# Altium project Computer_Board.PrjPcb (part 2 of 3)

## Sheet SCH7_Main_Computer_PCIe.SchDoc: Main Computer - PCIe
size B; Organization: CWRUbotix; Address1: 10900 Euclid Avenue; Address2: Cleveland, OH 44106; Address3: USA; Revision: 1.0; SheetNumber: 7; SheetTotal: 13
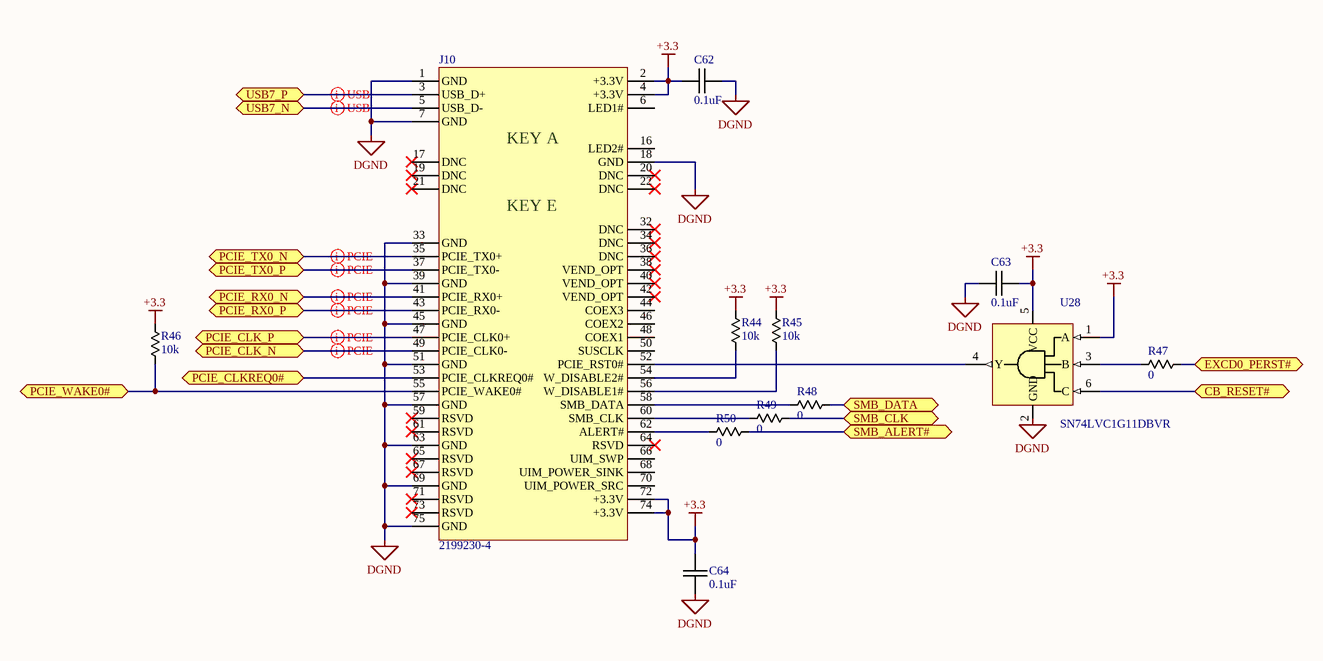
[diagram p6: SCH7_Main_Computer_PCIe.SchDoc]

### Parts
C62  0.1uF  [chip_0603]
C63  0.1uF  [chip_0603]
C64  0.1uF  [chip_0603]
J10  2199230-4  [TE_CONN_2199230-4]
R44  10k  [chip_0603]
R45  10k  [chip_0603]
R46  10k  [chip_0603]
R47  0  [chip_0805]
R48  0  [chip_0805]
R49  0  [chip_0805]
R50  0  [chip_0805]
U28  SN74LVC1G11DBVR  [sot-23-6]

### Ports
CB_RESET# (bidir), EXCD0_PERST# (bidir), PCIE_CLK_N (bidir), PCIE_CLK_P (bidir), PCIE_CLKREQ0# (bidir), PCIE_RX0_N (bidir), PCIE_RX0_P (bidir), PCIE_TX0_N (bidir), PCIE_TX0_P (bidir), PCIE_WAKE0# (bidir), SMB_ALERT# (bidir), SMB_CLK (bidir), SMB_DATA (bidir), USB7_N (bidir), USB7_P (bidir)

### Nets
+3.3: C62.1 C63.2 C64.2 J10.2(+3.3V) J10.4(+3.3V) J10.72(+3.3V) J10.74(+3.3V) R44.1 R45.1 R46.1 U28.1(A) U28.5(VCC)
DGND: C62.2 C63.1 C64.1 J10.1(GND) J10.7(GND) J10.18(GND) J10.33(GND) J10.39(GND) J10.45(GND) J10.51(GND) J10.57(GND) J10.63(GND) J10.69(GND) J10.75(GND) U28.2(GND)
CB_RESET#: U28.6(C) ; port CB_RESET#
EXCD0_PERST#: R47.1 ; port EXCD0_PERST#
PCIE_CLK_N: J10.49(PCIE_CLK0-) ; port PCIE_CLK_N
PCIE_CLK_P: J10.47(PCIE_CLK0+) ; port PCIE_CLK_P
PCIE_CLKREQ0#: J10.53(PCIE_CLKREQ0#) ; port PCIE_CLKREQ0#
PCIE_RX0_N: J10.41(PCIE_RX0+) ; port PCIE_RX0_N
PCIE_RX0_P: J10.43(PCIE_RX0-) ; port PCIE_RX0_P
PCIE_TX0_N: J10.35(PCIE_TX0+) ; port PCIE_TX0_N
PCIE_TX0_P: J10.37(PCIE_TX0-) ; port PCIE_TX0_P
PCIE_WAKE0#: J10.55(PCIE_WAKE0#) R46.2 ; port PCIE_WAKE0#
SMB_ALERT#: R50.1 ; port SMB_ALERT#
SMB_CLK: R49.1 ; port SMB_CLK
SMB_DATA: R48.1 ; port SMB_DATA
USB7_N: J10.5(USB_D-) ; port USB7_N
USB7_P: J10.3(USB_D+) ; port USB7_P
NetJ10_52: J10.52(PCIE_RST0#) U28.4(Y)
NetJ10_54: J10.54(W_DISABLE2#) R44.2
NetJ10_56: J10.56(W_DISABLE1#) R45.2
NetJ10_58: J10.58(SMB_DATA) R48.2
NetJ10_60: J10.60(SMB_CLK) R49.2
NetJ10_62: J10.62(ALERT#) R50.2
NetR47_2: R47.2 U28.3(B)

Not connected (* = marked no-connect by the designer): J10 6(LED1#) 16(LED2#) 17(DNC)* 19(DNC)* 20(DNC)* 21(DNC)* 22(DNC)* 32(DNC)* 34(DNC)* 36(DNC)* 38(VEND_OPT)* 40(VEND_OPT)* 42(VEND_OPT)* 44(COEX3) 46(COEX2) 48(COEX1) 50(SUSCLK) 59(RSVD)* 61(RSVD)* 64(RSVD)* 65(RSVD)* 66(UIM_SWP) 67(RSVD)* 68(UIM_POWER_SINK) 70(UIM_POWER_SRC) 71(RSVD)* 73(RSVD)*

### Layout directives
differential pair: PCIE_CLK_N, PCIE_CLK_P, PCIE_RX0_N, PCIE_RX0_P, PCIE_TX0_N, PCIE_TX0_P, USB7_N, USB7_P

### Notes on the sheet
- Title
- Size:
- B
- Number:
- Revision:
- Date:
- Sheet
- of
- (in symbol CONN-00088) KEY A; KEY E

### Library data of the parts
C62-C64 = CAP-00542: as C1 on sheet SCH1_Power; Part Number: CAP-00542; Capacitance: 0.1uF; Tolerance: ±10%; Voltage Rating: 16V; Type: X7R
J10 = CONN-00088: Card-Edge Socket, NGFF (M.2) E-Keyed, PCIe Card Socket; Manufacturer: TE Connectivity; Part Number: CONN-00088; Type: Card Socket; Manufacturer PN: 2199230-4; Cost: 1.33
R44-R46 = RES-00306: as R1 on sheet SCH1_Power; Part Number: RES-00306; Resistance: 10k; Tolerance: 1%; Cost: 0.144
R47-R50 = RES-00720: as R125 on sheet SCH1_Power; Part Number: RES-00720; Resistance: 0; Power Rating: 1/8W; Cost: 0.1
U28 = LOGIC-00042: IC, AND Gate, Single 3-Input, 1.65-5.5V, SOT-23-6; Manufacturer: TI; Part Number: LOGIC-00042; Manufacturer PN: SN74LVC1G11DBVR; Cost: $0.37

## Sheet SCH8_BBB.SchDoc: Beaglebone Black
size B; Organization: CWRUbotix; Address1: 10900 Euclid Avenue; Address2: Cleveland, OH 44106; Address3: USA; Revision: 1.0; SheetNumber: 8; SheetTotal: 13
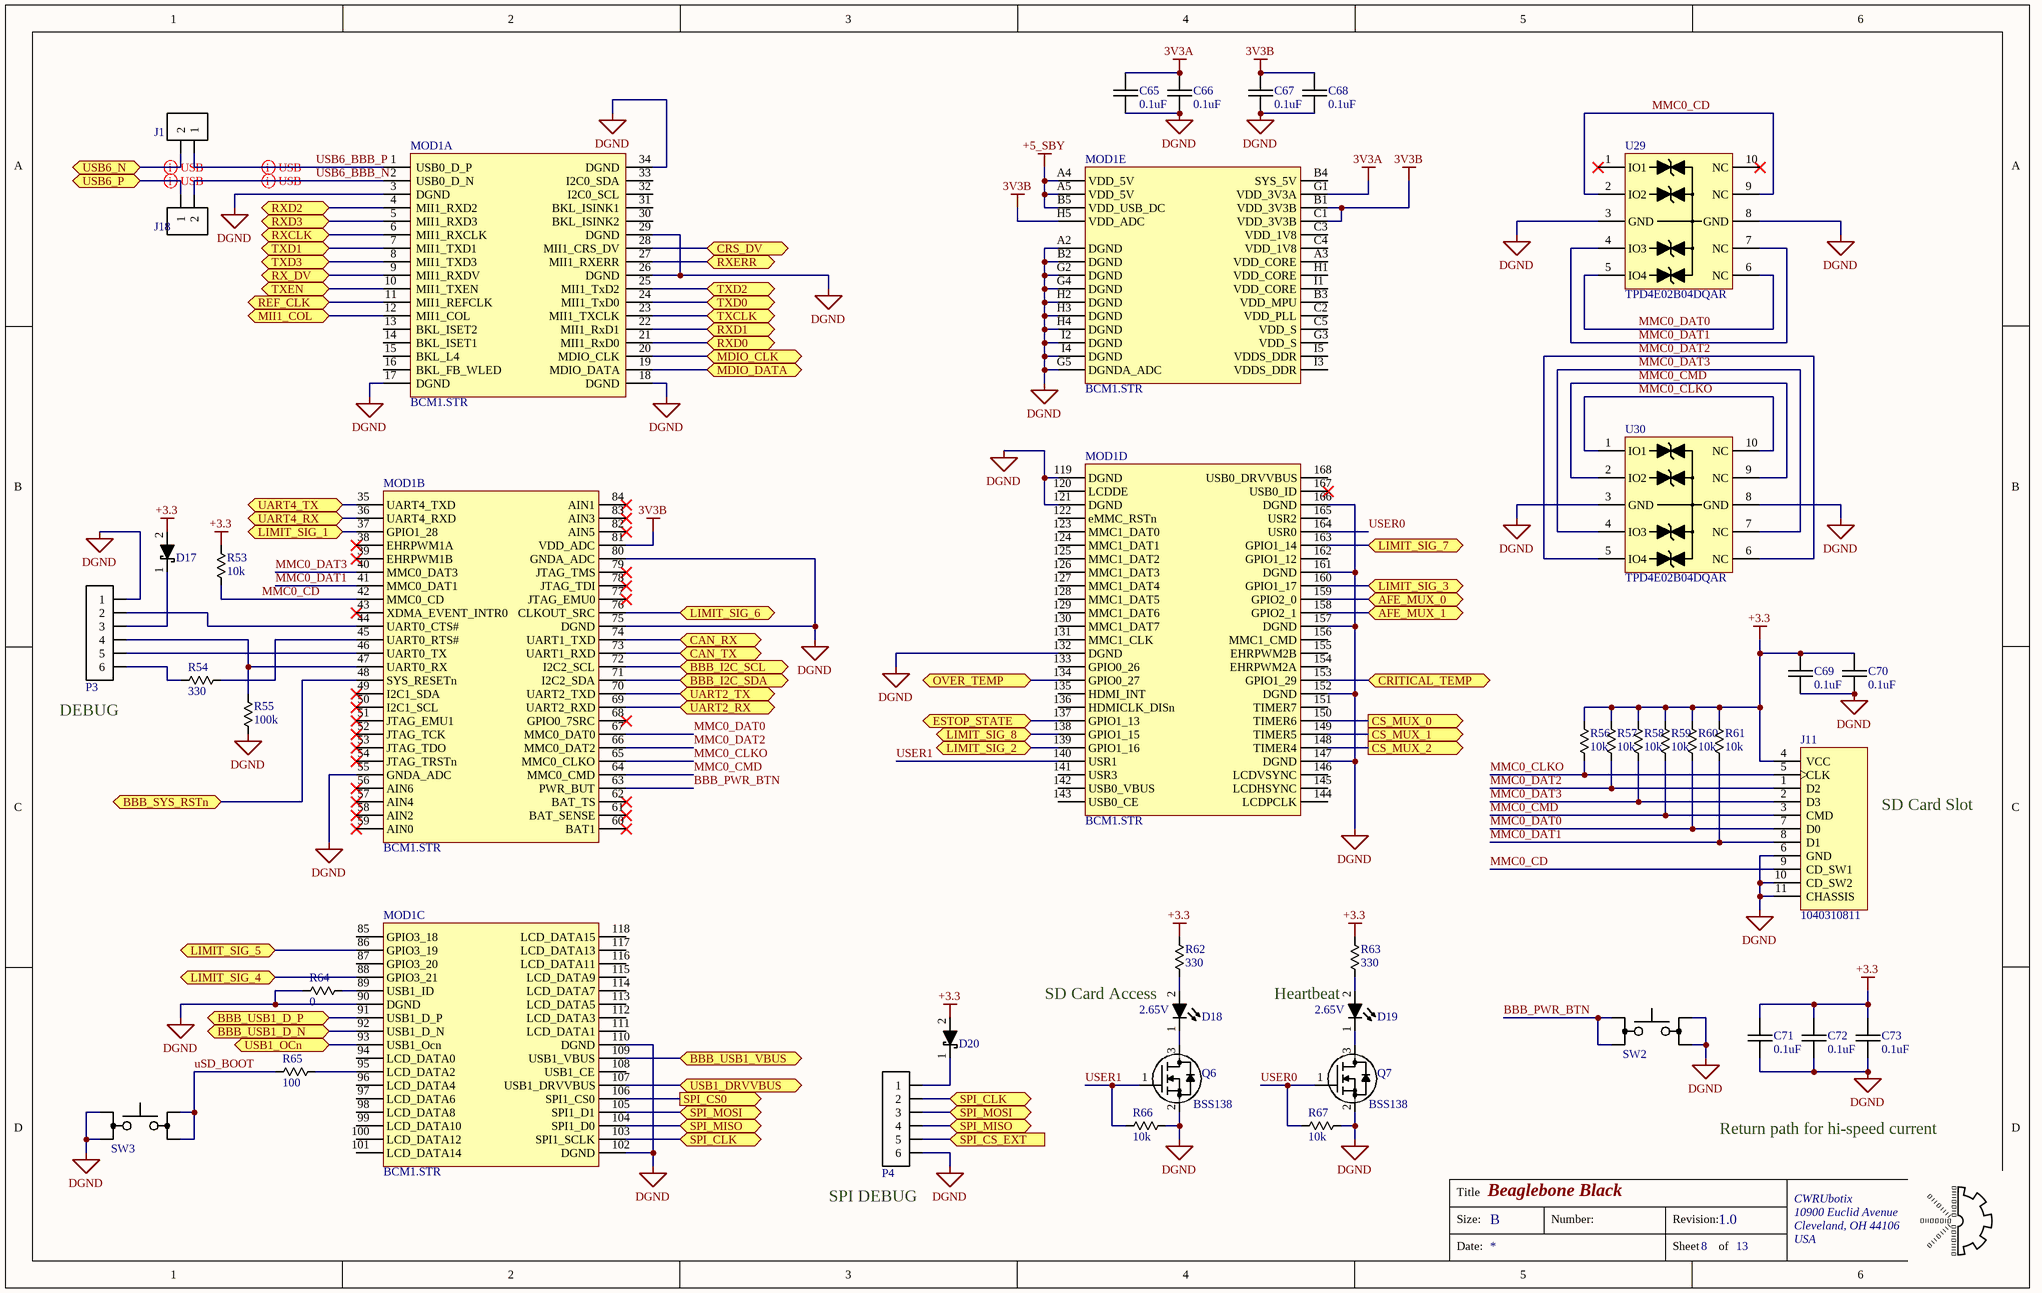
[diagram p7: SCH8_BBB.SchDoc]

### Parts
C65  0.1uF  [chip_0603]
C66  0.1uF  [chip_0603]
C67  0.1uF  [chip_0603]
C68  0.1uF  [chip_0603]
C69  0.1uF  [chip_0603]
C70  0.1uF  [chip_0603]
C71  0.1uF  [chip_0603]
C72  0.1uF  [chip_0603]
C73  0.1uF  [chip_0603]
D17  diode_2  [sod123_0]  (value not drawn)
D18  Forward Voltage: 2.65V  [chip_0603_LED]  (hidden comment: diode_4)
D19  Forward Voltage: 2.65V  [chip_0603_LED]  (hidden comment: diode_4)
D20  diode_2  [sod123_0]  (value not drawn)
J1  conn-2x1_0  [HDDR_2x1_0]  (value not drawn)
J11  1040310811  [MOLEX_1040310811]
J18  conn-2x1_0  [HDDR_2x1_0]  (value not drawn)
MOD1  BCM1.STR  [BEAGLECORE_BCM1]  (parts A,B,C,D,E of 5)
P3  conn-6x1_0  [HDDR_6X1_0]  (value not drawn)
P4  conn-6x1_0  [HDDR_6X1_0]  (value not drawn)
Q6  Manufacturer PN: BSS138  [sot-23-3]  (hidden comment: n-mosfet_1)
Q7  Manufacturer PN: BSS138  [sot-23-3]  (hidden comment: n-mosfet_1)
R53  10k  [chip_0603]
R54  330  [chip_0603]
R55  100k  [chip_0603]
R56  10k  [chip_0603]
R57  10k  [chip_0603]
R58  10k  [chip_0603]
R59  10k  [chip_0603]
R60  10k  [chip_0603]
R61  10k  [chip_0603]
R62  330  [chip_0603]
R63  330  [chip_0603]
R64  0  [chip_0805]
R65  100  [chip_0603]
R66  10k  [chip_0603]
R67  10k  [chip_0603]
SW2  SW_1P1T_2  [B3FS-1000]  (value not drawn)
SW3  SW_1P1T_2  [B3FS-1000]  (value not drawn)
U29  TPD4E02B04DQAR  [USON-10]
U30  TPD4E02B04DQAR  [USON-10]

### Ports
AFE_MUX_0 (bidir), AFE_MUX_1 (bidir), BBB_I2C_SCL (bidir), BBB_I2C_SDA (bidir), BBB_SYS_RSTn (bidir), BBB_USB1_D_N (bidir), BBB_USB1_D_P (bidir), BBB_USB1_VBUS (bidir), CAN_RX (bidir), CAN_TX (bidir), CRITICAL_TEMP (bidir), CRS_DV (bidir), CS_MUX_0 (out), CS_MUX_1 (out), CS_MUX_2 (out), ESTOP_STATE (bidir), LIMIT_SIG_1 (bidir), LIMIT_SIG_2 (bidir), LIMIT_SIG_3 (bidir), LIMIT_SIG_4 (bidir), LIMIT_SIG_5 (bidir), LIMIT_SIG_6 (bidir), LIMIT_SIG_7 (bidir), LIMIT_SIG_8 (bidir), MDIO_CLK (bidir), MDIO_DATA (bidir), MII1_COL (bidir), OVER_TEMP (bidir), REF_CLK (bidir), RX_DV (bidir), RXCLK (bidir), RXD0 (bidir), RXD1 (bidir), RXD2 (bidir), RXD3 (bidir), RXERR (bidir), SPI_CLK (bidir), SPI_CS0 (out), SPI_CS_EXT (in), SPI_MISO (bidir), SPI_MOSI (bidir), TXCLK (bidir), TXD0 (bidir), TXD1 (bidir), TXD2 (bidir), TXD3 (bidir), TXEN (bidir), UART2_RX (bidir), UART2_TX (bidir), UART4_RX (bidir), UART4_TX (bidir), USB1_DRVVBUS (bidir), USB1_OCn (bidir), USB6_N (bidir), USB6_P (bidir)

### Nets
3V3A: C65.2 C66.2 MOD1.G1(VDD_3V3A)
3V3B: C67.2 C68.2 MOD1.81(VDD_ADC) MOD1.B1(VDD_3V3B) MOD1.C1(VDD_3V3B) MOD1.H5(VDD_ADC)
+3.3: C69.2 C70.2 C71.2 C72.2 C73.2 D17.2 D20.2 J11.4(VCC) R53.1 R56.1 R57.1 R58.1 R59.1 R60.1 R61.1 R62.2 R63.2
+5_SBY: MOD1.A4(VDD_5V) MOD1.A5(VDD_5V) MOD1.B5(VDD_USB_DC)
DGND: C65.1 C66.1 C67.1 C68.1 C69.1 C70.1 C71.1 C72.1 C73.1 J11.6(GND) J11.10(CD_SW2) J11.11(CHASSIS) MOD1.3(DGND) MOD1.17(DGND) MOD1.18(DGND) MOD1.26(DGND) MOD1.29(DGND) MOD1.34(DGND) MOD1.55(GNDA_ADC) MOD1.75(DGND) MOD1.80(GNDA_ADC) MOD1.90(DGND) MOD1.102(DGND) MOD1.110(DGND) MOD1.119(DGND) MOD1.121(DGND) MOD1.132(DGND) MOD1.147(DGND) MOD1.152(DGND) MOD1.157(DGND) MOD1.161(DGND) MOD1.166(DGND) MOD1.A2(DGND) MOD1.B2(DGND) MOD1.G2(DGND) MOD1.G4(DGND) MOD1.G5(DGNDA_ADC) MOD1.H2(DGND) MOD1.H3(DGND) MOD1.H4(DGND) MOD1.I2(DGND) MOD1.I4(DGND) P3.1 P4.6 Q6.2(S) Q7.2(S) R55.1 R64.1 R66.2 R67.2 SW2.3 SW2.4 SW3.1 SW3.2 U29.3(GND) U29.8(GND) U30.3(GND) U30.8(GND)
AFE_MUX_0: MOD1.159(GPIO2_0) ; port AFE_MUX_0
AFE_MUX_1: MOD1.158(GPIO2_1) ; port AFE_MUX_1
BBB_I2C_SCL: MOD1.72(I2C2_SCL) ; port BBB_I2C_SCL
BBB_I2C_SDA: MOD1.71(I2C2_SDA) ; port BBB_I2C_SDA
BBB_PWR_BTN: MOD1.63(PWR_BUT) SW2.1 SW2.2
BBB_SYS_RSTn: MOD1.48(SYS_RESETn) ; port BBB_SYS_RSTn
BBB_USB1_D_N: MOD1.92(USB1_D_N) ; port BBB_USB1_D_N
BBB_USB1_D_P: MOD1.91(USB1_D_P) ; port BBB_USB1_D_P
BBB_USB1_VBUS: MOD1.109(USB1_VBUS) ; port BBB_USB1_VBUS
CAN_RX: MOD1.74(UART1_TXD) ; port CAN_RX
CAN_TX: MOD1.73(UART1_RXD) ; port CAN_TX
CRITICAL_TEMP: MOD1.153(GPIO1_29) ; port CRITICAL_TEMP
CRS_DV: MOD1.28(MII1_CRS_DV) ; port CRS_DV
CS_MUX_0: MOD1.150(TIMER6) ; port CS_MUX_0
CS_MUX_1: MOD1.149(TIMER5) ; port CS_MUX_1
CS_MUX_2: MOD1.148(TIMER4) ; port CS_MUX_2
ESTOP_STATE: MOD1.137(GPIO1_13) ; port ESTOP_STATE
LIMIT_SIG_1: MOD1.37(GPIO1_28) ; port LIMIT_SIG_1
LIMIT_SIG_2: MOD1.139(GPIO1_16) ; port LIMIT_SIG_2
LIMIT_SIG_3: MOD1.160(GPIO1_17) ; port LIMIT_SIG_3
LIMIT_SIG_4: MOD1.88(GPIO3_21) ; port LIMIT_SIG_4
LIMIT_SIG_5: MOD1.86(GPIO3_19) ; port LIMIT_SIG_5
LIMIT_SIG_6: MOD1.76(CLKOUT_SRC) ; port LIMIT_SIG_6
LIMIT_SIG_7: MOD1.163(GPIO1_14) ; port LIMIT_SIG_7
LIMIT_SIG_8: MOD1.138(GPIO1_15) ; port LIMIT_SIG_8
MDIO_CLK: MOD1.20(MDIO_CLK) ; port MDIO_CLK
MDIO_DATA: MOD1.19(MDIO_DATA) ; port MDIO_DATA
MII1_COL: MOD1.12(MII1_COL) ; port MII1_COL
MMC0_CD: J11.9(CD_SW1) MOD1.42(MMC0_CD) R53.2 U29.2(IO2) U29.9(NC)
MMC0_CLKO: J11.5(CLK) MOD1.65(MMC0_CLKO) R56.2 U30.1(IO1) U30.10(NC)
MMC0_CMD: J11.3(CMD) MOD1.64(MMC0_CMD) R59.2 U30.2(IO2) U30.9(NC)
MMC0_DAT0: J11.7(D0) MOD1.67(MMC0_DAT0) R60.2 U29.5(IO4) U29.6(NC)
MMC0_DAT1: J11.8(D1) MOD1.41(MMC0_DAT1) R61.2 U29.4(IO3) U29.7(NC)
MMC0_DAT2: J11.1(D2) MOD1.66(MMC0_DAT2) R57.2 U30.5(IO4) U30.6(NC)
MMC0_DAT3: J11.2(D3) MOD1.40(MMC0_DAT3) R58.2 U30.4(IO3) U30.7(NC)
OVER_TEMP: MOD1.134(GPIO0_27) ; port OVER_TEMP
REF_CLK: MOD1.11(MII1_REFCLK) ; port REF_CLK
RX_DV: MOD1.9(MII1_RXDV) ; port RX_DV
RXCLK: MOD1.6(MII1_RXCLK) ; port RXCLK
RXD0: MOD1.21(MII1_RxD0) ; port RXD0
RXD1: MOD1.22(MII1_RxD1) ; port RXD1
RXD2: MOD1.4(MII1_RXD2) ; port RXD2
RXD3: MOD1.5(MII1_RXD3) ; port RXD3
RXERR: MOD1.27(MII1_RXERR) ; port RXERR
SPI_CLK: MOD1.103(SPI1_SCLK) P4.2 ; port SPI_CLK
SPI_CS0: MOD1.106(SPI1_CS0) ; port SPI_CS0
SPI_CS_EXT: P4.5 ; port SPI_CS_EXT
SPI_MISO: MOD1.104(SPI1_D0) P4.4 ; port SPI_MISO
SPI_MOSI: MOD1.105(SPI1_D1) P4.3 ; port SPI_MOSI
TXCLK: MOD1.23(MII1_TXCLK) ; port TXCLK
TXD0: MOD1.24(MII1_TxD0) ; port TXD0
TXD1: MOD1.7(MII1_TXD1) ; port TXD1
TXD2: MOD1.25(MII1_TxD2) ; port TXD2
TXD3: MOD1.8(MII1_TXD3) ; port TXD3
TXEN: MOD1.10(MII1_TXEN) ; port TXEN
UART2_RX: MOD1.69(UART2_RXD) ; port UART2_RX
UART2_TX: MOD1.70(UART2_TXD) ; port UART2_TX
UART4_RX: MOD1.36(UART4_RXD) ; port UART4_RX
UART4_TX: MOD1.35(UART4_TXD) ; port UART4_TX
USB1_DRVVBUS: MOD1.107(USB1_DRVVBUS) ; port USB1_DRVVBUS
USB1_OCn: MOD1.93(USB1_Ocn) ; port USB1_OCn
USB6_BBB_N: J18.2 MOD1.2(USB0_D_N)
USB6_BBB_P: J1.1 MOD1.1(USB0_D_P)
USB6_N: J1.2 ; port USB6_N
USB6_P: J18.1 ; port USB6_P
uSD_BOOT: R65.1 SW3.3 SW3.4
USER0: MOD1.164(USR0) Q7.1(G) R67.1
USER1: MOD1.140(USR1) Q6.1(G) R66.1
NetD17_1: D17.1 P3.3
NetD18_1: D18.1 Q6.3(D)
NetD18_2: D18.2 R62.1
NetD19_1: D19.1 Q7.3(D)
NetD19_2: D19.2 R63.1
NetD20_1: D20.1 P4.1
NetMOD1_44: MOD1.44(UART0_CTS#) P3.2
NetMOD1_45: MOD1.45(UART0_RTS#) R54.1
NetMOD1_46: MOD1.46(UART0_TX) P3.5
NetMOD1_47: MOD1.47(UART0_RX) P3.4 R55.2
NetMOD1_89: MOD1.89(USB1_ID) R64.2
NetMOD1_95: MOD1.95(LCD_DATA2) R65.2
NetP3_6: P3.6 R54.2

Not connected (* = marked no-connect by the designer): MOD1 13(BKL_ISET2) 14(BKL_ISET1) 15(BKL_L4) 16(BKL_FB_WLED) 30(BKL_ISINK2) 31(BKL_ISINK1) 32(I2C0_SCL) 33(I2C0_SDA) 38(EHRPWM1A)* 39(EHRPWM1B)* 43(XDMA_EVENT_INTR0)* 49(I2C1_SDA)* 50(I2C1_SCL)* 51(JTAG_EMU1)* 52(JTAG_TCK)* 53(JTAG_TDO)* 54(JTAG_TRSTn)* 56(AIN6)* 57(AIN4)* 58(AIN2)* 59(AIN0)* 60(BAT1)* 61(BAT_SENSE)* 62(BAT_TS)* 68(GPIO0_7SRC)* 77(JTAG_EMU0)* 78(JTAG_TDI)* 79(JTAG_TMS)* 82(AIN5)* 83(AIN3)* 84(AIN1)* 85(GPIO3_18) 87(GPIO3_20) 94(LCD_DATA0) 96(LCD_DATA4) 97(LCD_DATA6) 98(LCD_DATA8) 99(LCD_DATA10) 100(LCD_DATA12) 101(LCD_DATA14) 108(USB1_CE) 111(LCD_DATA1) 112(LCD_DATA3) 113(LCD_DATA5) 114(LCD_DATA7) 115(LCD_DATA9) 116(LCD_DATA11) 117(LCD_DATA13) 118(LCD_DATA15) 120(LCDDE) 122(eMMC_RSTn) 123(MMC1_DAT0) 124(MMC1_DAT1) 125(MMC1_DAT2) 126(MMC1_DAT3) 127(MMC1_DAT4) 128(MMC1_DAT5) 129(MMC1_DAT6) 130(MMC1_DAT7) 131(MMC1_CLK) 133(GPIO0_26) 135(HDMI_INT) 136(HDMICLK_DISn) 141(USR3) 142(USB0_VBUS) 143(USB0_CE) 144(LCDPCLK) 145(LCDHSYNC) 146(LCDVSYNC) 151(TIMER7) 154(EHRPWM2A) 155(EHRPWM2B) 156(MMC1_CMD) 162(GPIO1_12) 165(USR2) 167(USB0_ID)* 168(USB0_DRVVBUS) A3(VDD_CORE) B3(VDD_MPU) B4(SYS_5V) C2(VDD_PLL) C3(VDD_1V8) C4(VDD_1V8) C5(VDD_S) G3(VDD_S) H1(VDD_CORE) I1(VDD_CORE) I3(VDDS_DDR) I5(VDDS_DDR); U29 1(IO1)* 10(NC)*

### Layout directives
differential pair: USB6_BBB_N, USB6_BBB_P, USB6_N, USB6_P

### Notes on the sheet
- (near P3) DEBUG
- SD Card Slot
- SD Card Access
- (near D19) Heartbeat
- Return path for hi-speed current
- (near P4) SPI DEBUG
- Title
- Size:
- B
- Number:
- Revision:
- Date:
- Sheet
- of

### Library data of the parts
C65-C73 = CAP-00542: CAP, 0.1uF, ±10%, 16V, X7R, 0603; Manufacturer: Murata; Part Number: CAP-00542; Capacitance: 0.1uF; Tolerance: ±10%; Voltage Rating: 16V; Type: X7R
D17 D20 = DIO-00001: Dio Shtky, 1A, 0.55V, 40V, SOD-123; Manufacturer: ON Semi; Manufacturer PN: MBR140SFT1G; Forward Voltage: 550mV; Type: Schottky; Part Number: DIO-00001; Reverse Breakdown Voltage: 40V; Current Rating: 1A
D18 D19 = DIO-00049: LED, Blue, 0603, Low current, HELI2 Series; Manufacturer: Kingbright; Manufacturer PN: APT1608LVBC/D; Reverse Breakdown Voltage: 5V; Power Rating: 120mW; Current Rating: 30mA; Part Number: DIO-00049; Type: LED; Cost: 0.58
J1 J18 = CONN-00055: Header, 2x1, 0.1"; Manufacturer: Samtec; Manufacturer PN: TSW-102-07-F-S; Positions per level: 2; Levels: 1; Part Number: CONN-00055; Type: Header; Cost: 0.2
J11 = CONN-00091: Micro SD Card Slot, Push-Pull w/ Card-Detect Switch, SMD, Molex; Positions per level: 10; Levels: 1; Part Number: CONN-00091; Type: Card Socket; Manufacturer: Molex; Manufacturer PN: 1040310811; Cost: 2.02
MOD1 = UCTRL-00011: BeagleCore BCM1, System-On-Module (SOM); Part Number: UCTRL-00011; Manufacturer: BeagleCore; Manufacturer PN: BCM1.STR
P3 P4 = CONN-00008: Header 6x1, 0.1"; Positions per level: 6; Levels: 1; Part Number: CONN-00008
Q6 Q7 = XSTR-00017: XSTR NMOS, 220mA, 50V, Vgs 1.3V, SOT-23-3; Manufacturer: ON Semi; Max Power: 360mW; Type: NFET; Part Number: XSTR-00017; Max Voltage: 50V; Max Current: 220mA; Vgs/Vce: 1.3V; Cost: 0.31
R53 R56-R61 R66 R67 = RES-00306: RES SMD 10K OHM 1% 1/4W 0603; Manufacturer: Panasonic; Manufacturer PN: ERJ-PA3F1002V; Power Rating: 0.25W; Part Number: RES-00306; Resistance: 10k; Tolerance: 1%; Cost: 0.144
R54 R62 R63 = RES-00221: RES SMD 330 OHM 1% 1/4W 0603; Manufacturer: Panasonic; Manufacturer PN: ERJ-PA3F3300V; Power Rating: 0.25W; Part Number: RES-00221; Resistance: 330; Tolerance: 1%
R55 = RES-00301: RES SMD 100K OHM 1% 1/4W 0603; Manufacturer: Panasonic; Manufacturer PN: ERJ-PA3F1003V; Power Rating: 0.25W; Part Number: RES-00301; Resistance: 100k; Tolerance: 1%
R64 = RES-00720: RES SMD 0 OHM 1/8W 0805 Thick Film; Manufacturer: Stackpole; Manufacturer PN: RMCF0805ZT0R00; Tolerance: Jumper; Part Number: RES-00720; Resistance: 0; Power Rating: 1/8W; Cost: 0.1
R65 = RES-00178: RES SMD 100 OHM 1% 1/4W 0603; Manufacturer: Panasonic; Manufacturer PN: ERJ-PA3F1000V; Power Rating: 0.25W; Part Number: RES-00178; Resistance: 100; Tolerance: 1%
SW2 SW3 = MISC-00042: Switch, SPST-NO, Tactile, 6.3x6.0mm, SMD, 50mA 24VDC; Manufacturer: Omron; Manufacturer PN: B3FS-1012P; Part Number: MISC-00042; Cost: 0.71
U29 U30 = DIO-00068: TVS, 4-Ch, ESD Protec, 3.6V 8.8V 10-USON; Manufacturer: TI; Power Rating: 17W; Current Rating: 2A; Part Number: DIO-00068; Type: TVS; Manufacturer PN: TPD4E02B04DQAR; Cost: 0.56

## Sheet SCH9_BBB_Eth.SchDoc: Beaglebone Black - Ethernet
size B; Organization: CWRUbotix; Address1: 10900 Euclid Avenue; Address2: Cleveland, OH 44106; Address3: USA; Revision: 1.0; SheetNumber: 9; SheetTotal: 13
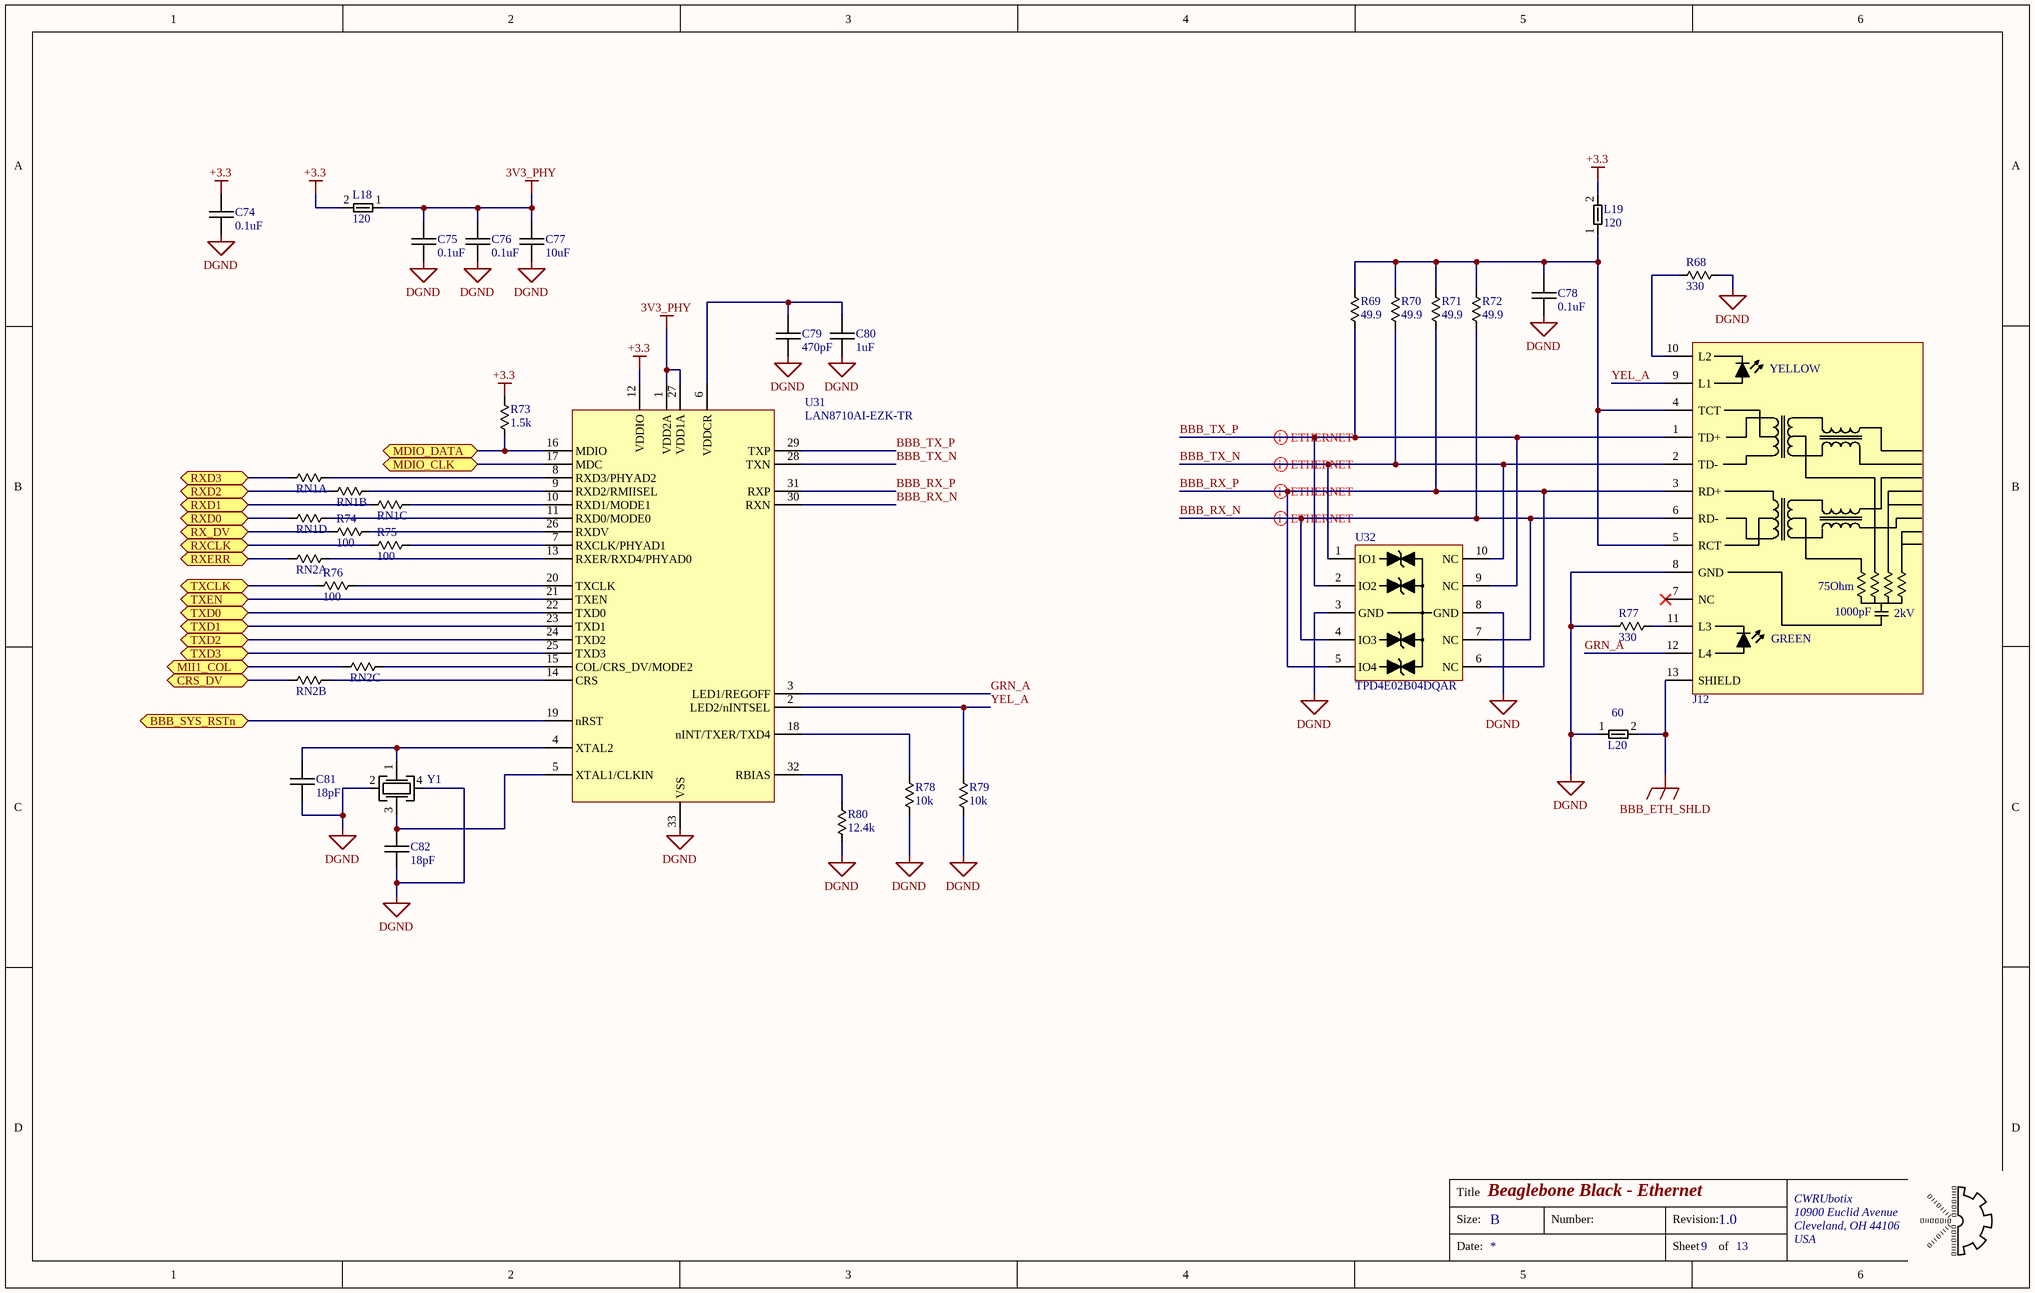
[diagram p8: SCH9_BBB_Eth.SchDoc]

### Parts
C74  0.1uF  [chip_0603]
C75  0.1uF  [chip_0603]
C76  0.1uF  [chip_0603]
C77  10uF  [chip_1206]
C78  0.1uF  [chip_0603]
C79  470pF  [chip_0603]
C80  1uF  [chip_0805]
C81  18pF  [chip_0603]
C82  18pF  [chip_0603]
J12  amphenol-RJMG1B  [AMPHENOL_RJMG1B]  (value not drawn)
L18  Impedance: 120  [CHIP_0603_FE]  (hidden comment: bead_0)
L19  Impedance: 120  [CHIP_0603_FE]  (hidden comment: bead_0)
L20  Impedance: 60  [CHIP_0805_FE]  (hidden comment: bead_0)
R68  330  [chip_0603]
R69  49.9  [chip_0603]
R70  49.9  [chip_0603]
R71  49.9  [chip_0603]
R72  49.9  [chip_0603]
R73  1.5k  [chip_0603]
R74  100  [chip_0603]
R75  100  [chip_0603]
R76  100  [chip_0603]
R77  330  [chip_0603]
R78  10k  [chip_0603]
R79  10k  [chip_0603]
R80  12.4k  [chip_0603]
RN1  res_array_4  [chip_1206_arr]  (value not drawn)  (parts A,B,C,D of 4)
RN2  res_array_4  [chip_1206_arr]  (value not drawn)  (parts A,B,C of 4)
U31  LAN8710AI-EZK-TR  [QFN-32-EP]
U32  TPD4E02B04DQAR  [USON-10]
Y1  osc_xtal_4p_1-3  [ECX-32]  (value not drawn)

### Ports
BBB_SYS_RSTn (bidir), CRS_DV (bidir), MDIO_CLK (bidir), MDIO_DATA (bidir), MII1_COL (bidir), RX_DV (bidir), RXCLK (bidir), RXD0 (bidir), RXD1 (bidir), RXD2 (bidir), RXD3 (bidir), RXERR (bidir), TXCLK (bidir), TXD0 (bidir), TXD1 (bidir), TXD2 (bidir), TXD3 (bidir), TXEN (bidir)

### Nets
3V3_PHY: C75.2 C76.2 C77.1 L18.1 U31.1(VDD2A) U31.27(VDD1A)
+3.3: C74.2 L18.2 L19.2 R73.1 U31.12(VDDIO)
BBB_ETH_SHLD: J12.13(SHIELD) L20.2
DGND: C74.1 C75.1 C76.1 C77.2 C78.1 C79.2 C80.2 C81.2 C82.2 J12.8(GND) L20.1 R68.1 R77.2 R78.2 R79.2 R80.2 U31.33(VSS) U32.3(GND) U32.8(GND) Y1.2(GND) Y1.4(GND)
BBB_RX_N: J12.6(RD-) R72.2 U31.30(RXN) U32.4(IO3) U32.7(NC)
BBB_RX_P: J12.3(RD+) R71.2 U31.31(RXP) U32.5(IO4) U32.6(NC)
BBB_SYS_RSTn: U31.19(nRST) ; port BBB_SYS_RSTn
BBB_TX_N: J12.2(TD-) R70.2 U31.28(TXN) U32.1(IO1) U32.10(NC)
BBB_TX_P: J12.1(TD+) R69.2 U31.29(TXP) U32.2(IO2) U32.9(NC)
CRS_DV: RN2.2 ; port CRS_DV
GRN_A: J12.12(L4) U31.3(LED1/REGOFF)
MDIO_CLK: U31.17(MDC) ; port MDIO_CLK
MDIO_DATA: R73.2 U31.16(MDIO) ; port MDIO_DATA
MII1_COL: RN2.3 ; port MII1_COL
RX_DV: R74.1 ; port RX_DV
RXCLK: R75.1 ; port RXCLK
RXD0: RN1.4 ; port RXD0
RXD1: RN1.3 ; port RXD1
RXD2: RN1.2 ; port RXD2
RXD3: RN1.1 ; port RXD3
RXERR: RN2.1 ; port RXERR
TXCLK: R76.1 ; port TXCLK
TXD0: U31.22(TXD0) ; port TXD0
TXD1: U31.23(TXD1) ; port TXD1
TXD2: U31.24(TXD2) ; port TXD2
TXD3: U31.25(TXD3) ; port TXD3
TXEN: U31.21(TXEN) ; port TXEN
YEL_A: J12.9(L1) R79.1 U31.2(LED2/nINTSEL)
NetC78_2: C78.2 J12.4(TCT) J12.5(RCT) L19.1 R69.1 R70.1 R71.1 R72.1
NetC79_1: C79.1 C80.1 U31.6(VDDCR)
NetC81_1: C81.1 U31.4(XTAL2) Y1.1
NetC82_1: C82.1 U31.5(XTAL1/CLKIN) Y1.3
NetJ12_10: J12.10(L2) R68.2
NetJ12_11: J12.11(L3) R77.1
NetR74_2: R74.2 U31.26(RXDV)
NetR75_2: R75.2 U31.7(RXCLK/PHYAD1)
NetR76_2: R76.2 U31.20(TXCLK)
NetR78_1: R78.1 U31.18(nINT/TXER/TXD4)
NetR80_1: R80.1 U31.32(RBIAS)
NetRN1_5: RN1.5 U31.11(RXD0/MODE0)
NetRN1_6: RN1.6 U31.10(RXD1/MODE1)
NetRN1_7: RN1.7 U31.9(RXD2/RMIISEL)
NetRN1_8: RN1.8 U31.8(RXD3/PHYAD2)
NetRN2_6: RN2.6 U31.15(COL/CRS_DV/MODE2)
NetRN2_7: RN2.7 U31.14(CRS)
NetRN2_8: RN2.8 U31.13(RXER/RXD4/PHYAD0)

Not connected (* = marked no-connect by the designer): J12 7(NC)*

### Layout directives
differential pair: BBB_RX_N, BBB_RX_P, BBB_TX_N, BBB_TX_P

### Notes on the sheet
- Title
- Size:
- B
- Number:
- Revision:
- Date:
- Sheet
- of
- (in symbol CONN-00057) YELLOW; 75Ohm; 1000pF; 2kV; GREEN

### Library data of the parts
C74-C76 C78 = CAP-00542: as C65-C73 on sheet SCH8_BBB; Part Number: CAP-00542; Capacitance: 0.1uF; Tolerance: ±10%; Voltage Rating: 16V; Type: X7R
C77 = CAP-00539: CAP, 10uF, ±10%, 25V, X7R, 1206; Manufacturer: Samsung; Manufacturer PN: CL31B106KAHNNNE; Part Number: CAP-00539; Capacitance: 10uF; Tolerance: ±10%; Voltage Rating: 25V; Type: X7R
C79 = CAP-00429: CAP, 470pF, ±2%, 50V, C0G, 0603; Manufacturer: Murata; Manufacturer PN: GRM1885C1H471GA01D; Part Number: CAP-00429; Capacitance: 470pF; Tolerance: ±2%; Voltage Rating: 50V; Type: C0G
C80 = CAP-00110: CAP, 1uF, 10%, 16V, X7R, 0805; Manufacturer: Murata; Manufacturer PN: GRM21BR71C105KA01K; Part Number: CAP-00110; Capacitance: 1uF; Tolerance: 10%; Voltage Rating: 16V; Type: X7R
C81 C82 = CAP-00409: CAP, 18pF, ±2%, 50V, C0G, 0603; Manufacturer: Murata; Manufacturer PN: GRM1885C1H180GA01D; Part Number: CAP-00409; Capacitance: 18pF; Tolerance: ±2%; Voltage Rating: 50V; Type: C0G
J12 = CONN-00057: RJ45 Modular Mag-Jack, 8P8C, 10/100 Base-T; Manufacturer PN: RJMG1BD3B8K1ANR; Part Number: CONN-00057; Type: Jack; Manufacturer: Amphenol; Cost: 3.92
L18 L19 = MAG-00126: Fe Bead, 120 @ 100MHz, 800mA, 0603; Manufacturer: Murata; Manufacturer PN: BLM18AG121SN1D; DCR: 180mOhm; Part Number: MAG-00126; Current Rating: 800mA; Test Freq: 100MHz; Cost: 0.1
L20 = MAG-00125: Fe Bead, 60 @ 100MH, 3A, 0805; Manufacturer: Pulse Electronics; Manufacturer PN: PE-0805PFB600ST; Test Freq: 100MHz; DCR: 25mOhm; Part Number: MAG-00125; Current Rating: 3A; Cost: 0.1
R68 R77 = RES-00221: as R54 on sheet SCH8_BBB; Part Number: RES-00221; Resistance: 330; Tolerance: 1%
R69-R72 = RES-00705: RES SMD 49.9 OHM 1% 1/10W 0603; Manufacturer: Yageo; Manufacturer PN: RC0603FR-0749R9L; Part Number: RES-00705; Resistance: 49.9; Tolerance: 1%; Power Rating: 1/10W; Cost: 0.1
R73 = RES-00284: RES SMD 1.5K OHM 1% 1/4W 0603; Manufacturer: Panasonic; Manufacturer PN: ERJ-PA3F1501V; Power Rating: 0.25W; Part Number: RES-00284; Resistance: 1.5k; Tolerance: 1%
R74-R76 = RES-00178: as R65 on sheet SCH8_BBB; Part Number: RES-00178; Resistance: 100; Tolerance: 1%
R78 R79 = RES-00306: as R53 on sheet SCH8_BBB; Part Number: RES-00306; Resistance: 10k; Tolerance: 1%; Cost: 0.144
R80 = RES-00721: RES SMD 12.4K OHM 1% 1/10W 0603; Manufacturer: Stackpole; Manufacturer PN: RMCF0603FT12K4; Part Number: RES-00721; Resistance: 12.4k; Tolerance: 1%; Power Rating: 1/10W; Cost: 0.1
RN1 RN2 = RES-00723: RES ARRAY 4 RES 100 OHM 5% 62.5mW 1206; Manufacturer: Panasonic; Manufacturer PN: EXB-38V101JV; Resistance: 100; Power Rating: 1/16W; Part Number: RES-00723; Tolerance: 5%; Cost: 0.1
U31 = IFACE-00025: IC, 10/100 Ethernet Transceiver; Manufacturer: Microchip; Part Number: IFACE-00025; Manufacturer PN: LAN8710AI-EZK-TR; Cost: 1.56
U32 = DIO-00068: as U29 on sheet SCH8_BBB; Part Number: DIO-00068; Type: TVS; Manufacturer PN: TPD4E02B04DQAR; Cost: 0.56
Y1 = OSC-00005: XTAL, 25MHz, 20pF, 20ppm; Manufacturer: ECS Inc.; Manufacturer PN: ECS-250-20-33-JTN-TR; Frequency: 25M; ESR: 40; Part Number: OSC-00005; Load Capacitance: 20pF; Stability: 20ppm; Tolerance: 20ppm; Cost: 0.56

## Sheet SCH10_BBB_USB.SchDoc: Beaglebone Black - USB
size B; Organization: CWRUbotix; Address1: 10900 Euclid Avenue; Address2: Cleveland, OH 44106; Address3: USA; Revision: 1.0; SheetNumber: 10; SheetTotal: 13
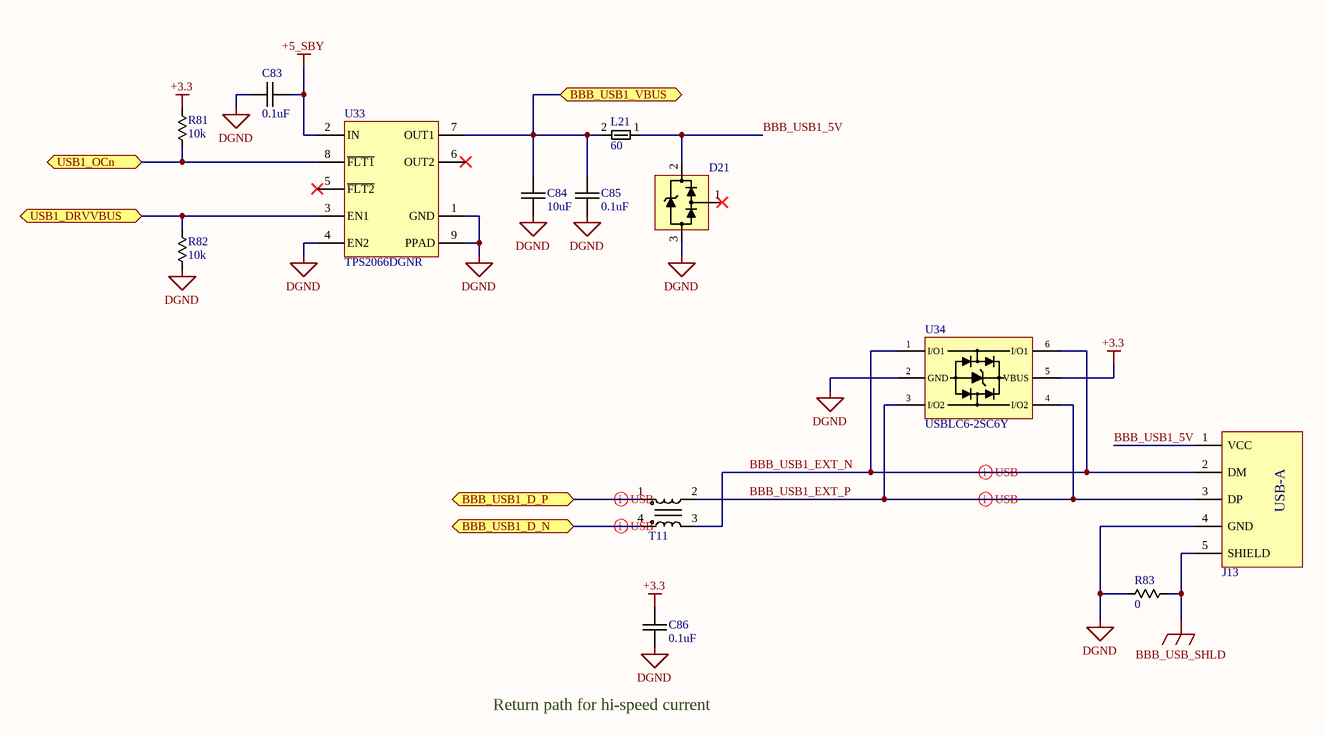
[diagram p9: SCH10_BBB_USB.SchDoc]

### Parts
C83  0.1uF  [chip_0603]
C84  10uF  [chip_1206]
C85  0.1uF  [chip_0603]
C86  0.1uF  [chip_0603]
D21  DLPT05  [sot-23-3]  (value not drawn)
J13  usb_a  [AMPHENOL_87583-3010RPALF]  (value not drawn)
L21  Impedance: 60  [CHIP_0805_FE]  (hidden comment: bead_0)
R81  10k  [chip_0603]
R82  10k  [chip_0603]
R83  0  [chip_0805]
T11  DLW21HN900SQ2L  [MURATA_DLW21H]  (value not drawn)
U33  TPS2066DGNR  [VSSOP-8-PPAD]
U34  USBLC6-2SC6Y  [sot-23-6]

### Ports
BBB_USB1_D_N (bidir), BBB_USB1_D_P (bidir), BBB_USB1_VBUS (bidir), USB1_DRVVBUS (bidir), USB1_OCn (bidir)

### Nets
+3.3: C86.1 R81.1 U34.5(VBUS)
+5_SBY: C83.1 U33.2(IN)
BBB_USB_SHLD: J13.5(SHIELD) R83.2
DGND: C83.2 C84.2 C85.1 C86.2 D21.3(GND) J13.4(GND) R82.2 R83.1 U33.1(GND) U33.4(EN2) U33.9(PPAD) U34.2(GND)
BBB_USB1_5V: D21.2(VCC) J13.1(VCC) L21.1
BBB_USB1_D_N: T11.4 ; port BBB_USB1_D_N
BBB_USB1_D_P: T11.1 ; port BBB_USB1_D_P
BBB_USB1_EXT_N: J13.2(DM) T11.3 U34.1(I/O1) U34.6(I/O1)
BBB_USB1_EXT_P: J13.3(DP) T11.2 U34.3(I/O2) U34.4(I/O2)
BBB_USB1_VBUS: C84.1 C85.2 L21.2 U33.7(OUT1) ; port BBB_USB1_VBUS
USB1_DRVVBUS: R82.1 U33.3(EN1) ; port USB1_DRVVBUS
USB1_OCn: R81.2 U33.8(~{FLT1}) ; port USB1_OCn

Not connected (* = marked no-connect by the designer): D21 1(LINE)*; U33 5(~{FLT2})* 6(OUT2)*

### Layout directives
differential pair: BBB_USB1_D_N, BBB_USB1_D_P, BBB_USB1_EXT_N, BBB_USB1_EXT_P

### Notes on the sheet
- Return path for hi-speed current
- Title
- Size:
- B
- Number:
- Revision:
- Date:
- Sheet
- of
- (in symbol CONN-00123) USB-A

### Library data of the parts
C83 C85 C86 = CAP-00542: as C65-C73 on sheet SCH8_BBB; Part Number: CAP-00542; Capacitance: 0.1uF; Tolerance: ±10%; Voltage Rating: 16V; Type: X7R
C84 = CAP-00539: as C77 on sheet SCH9_BBB_Eth; Part Number: CAP-00539; Capacitance: 10uF; Tolerance: ±10%; Voltage Rating: 25V; Type: X7R
D21 = DIO-00057: TVS, Steering (Rail-Rail), 9.8V Clamping, 17A Peak Pulse, SOT-23; Manufacturer: Diodes Incorporated; Manufacturer PN: DLPT05-7-F; Reverse Breakdown Voltage: 6.0V; Part Number: DIO-00057; Type: TVS; Cost: 0.38
J13 = CONN-00123: USB-A Receptacle x1, USB 2.0, Right-Angle, SMD; Manufacturer: Amphenol; Manufacturer PN: 87583-3010RPALF; Positions per level: 4; Levels: 1; Part Number: CONN-00123; Type: Receptacle; Cost: 0.89; Distributor Link: https://www.digikey.com/en/products/detail/amphenol-icc-fci/87583-3010RPALF/4266975
L21 = MAG-00125: as L20 on sheet SCH9_BBB_Eth; Part Number: MAG-00125; Current Rating: 3A; Cost: 0.1
R81 R82 = RES-00306: as R53 on sheet SCH8_BBB; Part Number: RES-00306; Resistance: 10k; Tolerance: 1%; Cost: 0.144
R83 = RES-00720: as R64 on sheet SCH8_BBB; Part Number: RES-00720; Resistance: 0; Power Rating: 1/8W; Cost: 0.1
T11 = MAG-00121: CMC, 330mA 2-CH 90 OHM @ 100MHz SMD; Manufacturer: Murata; Impedance: 90; DCR: 350mOhm; Part Number: MAG-00121; Test Freq: 100MHz; Manufacturer PN: DLW21HN900SQ2L; Cost: 0.53
U33 = PWREG-00052: IC, Power Switch 1:2, 8-MSOP; Manufacturer: TI; Voltage Range In: 2.7 ~ 5.5V; Max Current: 1A; Part Number: PWREG-00052; Voltage Range Out: 2.7 ~ 5.5V; Reg Type: Power Switch; Manufacturer PN: TPS2066DGNR; Cost: 1.56
U34 = DIO-00069: ESD Protec, 2-Ch, 2.5pF, 17V clamping voltage, SOT23-6; Manufacturer: ST; Forward Voltage: 1.1V; Reverse Breakdown Voltage: 6V; Current Rating: 5A; Part Number: DIO-00069; Type: TVS; Manufacturer PN: USBLC6-2SC6Y; Cost: 0.73

## Sheet SCH11_Digital_IO.SchDoc: Beaglebone Black - Digital IO
size B; Organization: CWRUbotix; Address1: 10900 Euclid Avenue; Address2: Cleveland, OH 44106; Address3: USA; Revision: 1.0; SheetNumber: 11; SheetTotal: 13
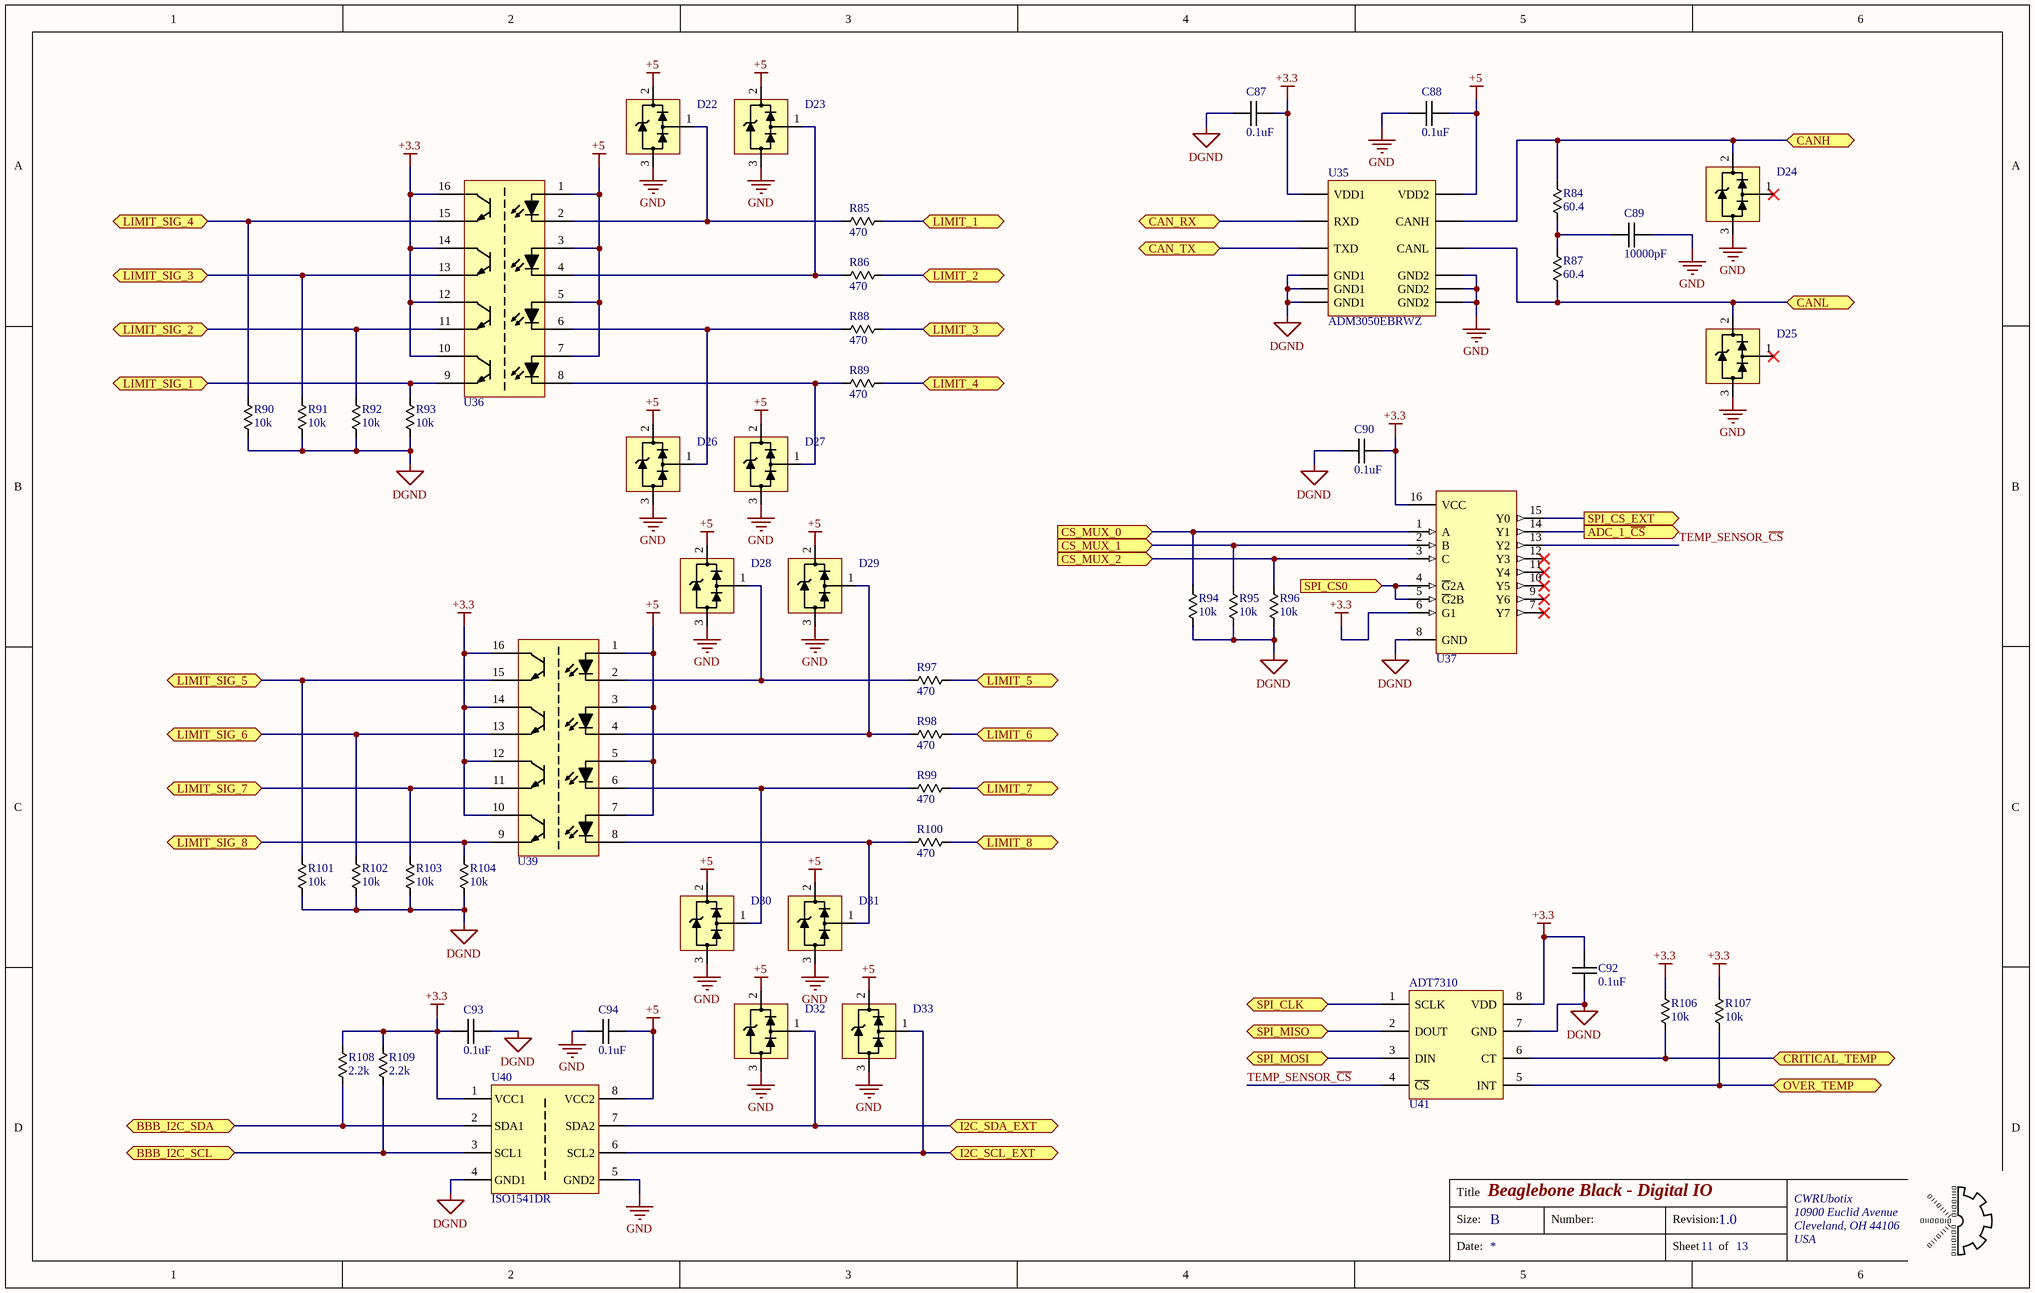
[diagram p10: SCH11_Digital_IO.SchDoc]

### Parts
C87  0.1uF  [chip_0603]
C88  0.1uF  [chip_0603]
C89  10000pF  [chip_0603]
C90  0.1uF  [chip_0603]
C92  0.1uF  [chip_0603]
C93  0.1uF  [chip_0603]
C94  0.1uF  [chip_0603]
D22  DLPT05  [sot-23-3]  (value not drawn)
D23  DLPT05  [sot-23-3]  (value not drawn)
D24  DLPT05  [sot-23-3]  (value not drawn)
D25  DLPT05  [sot-23-3]  (value not drawn)
D26  DLPT05  [sot-23-3]  (value not drawn)
D27  DLPT05  [sot-23-3]  (value not drawn)
D28  DLPT05  [sot-23-3]  (value not drawn)
D29  DLPT05  [sot-23-3]  (value not drawn)
D30  DLPT05  [sot-23-3]  (value not drawn)
D31  DLPT05  [sot-23-3]  (value not drawn)
D32  DLPT05  [sot-23-3]  (value not drawn)
D33  DLPT05  [sot-23-3]  (value not drawn)
R84  60.4  [chip_0805]
R85  470  [chip_0805]
R86  470  [chip_0805]
R87  60.4  [chip_0805]
R88  470  [chip_0805]
R89  470  [chip_0805]
R90  10k  [chip_0603]
R91  10k  [chip_0603]
R92  10k  [chip_0603]
R93  10k  [chip_0603]
R94  10k  [chip_0603]
R95  10k  [chip_0603]
R96  10k  [chip_0603]
R97  470  [chip_0805]
R98  470  [chip_0805]
R99  470  [chip_0805]
R100  470  [chip_0805]
R101  10k  [chip_0603]
R102  10k  [chip_0603]
R103  10k  [chip_0603]
R104  10k  [chip_0603]
R106  10k  [chip_0603]
R107  10k  [chip_0603]
R108  2.2k  [chip_0603]
R109  2.2k  [chip_0603]
U35  ADM3050EBRWZ  [SOW-16]
U36  TLP291-4  [SO-16-6.3mm]  (value not drawn)
U37  74HC138  [SO-16]  (value not drawn)
U39  TLP291-4  [SO-16-6.3mm]  (value not drawn)
U40  ISO1541DR  [SO-8]
U41  ADT7310  [SO-8_1]

### Ports
ADC_1_~{CS} (out), BBB_I2C_SCL (bidir), BBB_I2C_SDA (bidir), CAN_RX (bidir), CAN_TX (bidir), CANH (bidir), CANL (bidir), CRITICAL_TEMP (bidir), CS_MUX_0 (in), CS_MUX_1 (in), CS_MUX_2 (in), I2C_SCL_EXT (bidir), I2C_SDA_EXT (bidir), LIMIT_1 (bidir), LIMIT_2 (bidir), LIMIT_3 (bidir), LIMIT_4 (bidir), LIMIT_5 (bidir), LIMIT_6 (bidir), LIMIT_7 (bidir), LIMIT_8 (bidir), LIMIT_SIG_1 (bidir), LIMIT_SIG_2 (bidir), LIMIT_SIG_3 (bidir), LIMIT_SIG_4 (bidir), LIMIT_SIG_5 (bidir), LIMIT_SIG_6 (bidir), LIMIT_SIG_7 (bidir), LIMIT_SIG_8 (bidir), OVER_TEMP (bidir), SPI_CLK (bidir), SPI_CS0 (in), SPI_CS_EXT (out), SPI_MISO (bidir), SPI_MOSI (bidir)

### Nets
+3.3: C87.1 C90.1 C92.1 C93.2 R106.1 R107.1 R108.2 R109.2 U35.1(VDD1) U36.10 U36.12 U36.14 U36.16 U37.6(G1) U37.16(VCC) U39.10 U39.12 U39.14 U39.16 U40.1(VCC1) U41.8(VDD)
+5: C88.1 C94.1 D22.2(VCC) D23.2(VCC) D26.2(VCC) D27.2(VCC) D28.2(VCC) D29.2(VCC) D30.2(VCC) D31.2(VCC) D32.2(VCC) D33.2(VCC) U35.16(VDD2) U36.1 U36.3 U36.5 U36.7 U39.1 U39.3 U39.5 U39.7 U40.8(VCC2)
DGND: C87.2 C90.2 C92.2 C93.1 R90.2 R91.2 R92.2 R93.2 R94.2 R95.2 R96.2 R101.2 R102.2 R103.2 R104.2 U35.2(GND1) U35.7(GND1) U35.8(GND1) U37.8(GND) U40.4(GND1) U41.7(GND)
GND: C88.2 C89.2 C94.2 D22.3(GND) D23.3(GND) D24.3(GND) D25.3(GND) D26.3(GND) D27.3(GND) D28.3(GND) D29.3(GND) D30.3(GND) D31.3(GND) D32.3(GND) D33.3(GND) U35.9(GND2) U35.10(GND2) U35.15(GND2) U40.5(GND2)
ADC_1_~{CS}: U37.14(Y1) ; port ADC_1_~{CS}
BBB_I2C_SCL: R109.1 U40.3(SCL1) ; port BBB_I2C_SCL
BBB_I2C_SDA: R108.1 U40.2(SDA1) ; port BBB_I2C_SDA
CAN_RX: U35.3(RXD) ; port CAN_RX
CAN_TX: U35.6(TXD) ; port CAN_TX
CANH: D24.2(VCC) R84.1 U35.13(CANH) ; port CANH
CANL: D25.2(VCC) R87.2 U35.12(CANL) ; port CANL
CRITICAL_TEMP: R106.2 U41.6(CT) ; port CRITICAL_TEMP
CS_MUX_0: R94.1 U37.1(A) ; port CS_MUX_0
CS_MUX_1: R95.1 U37.2(B) ; port CS_MUX_1
CS_MUX_2: R96.1 U37.3(C) ; port CS_MUX_2
I2C_SCL_EXT: D33.1(LINE) U40.6(SCL2) ; port I2C_SCL_EXT
I2C_SDA_EXT: D32.1(LINE) U40.7(SDA2) ; port I2C_SDA_EXT
LIMIT_1: R85.2 ; port LIMIT_1
LIMIT_2: R86.2 ; port LIMIT_2
LIMIT_3: R88.2 ; port LIMIT_3
LIMIT_4: R89.2 ; port LIMIT_4
LIMIT_5: R97.2 ; port LIMIT_5
LIMIT_6: R98.2 ; port LIMIT_6
LIMIT_7: R99.2 ; port LIMIT_7
LIMIT_8: R100.2 ; port LIMIT_8
LIMIT_SIG_1: R93.1 U36.9 ; port LIMIT_SIG_1
LIMIT_SIG_2: R92.1 U36.11 ; port LIMIT_SIG_2
LIMIT_SIG_3: R91.1 U36.13 ; port LIMIT_SIG_3
LIMIT_SIG_4: R90.1 U36.15 ; port LIMIT_SIG_4
LIMIT_SIG_5: R101.1 U39.15 ; port LIMIT_SIG_5
LIMIT_SIG_6: R102.1 U39.13 ; port LIMIT_SIG_6
LIMIT_SIG_7: R103.1 U39.11 ; port LIMIT_SIG_7
LIMIT_SIG_8: R104.1 U39.9 ; port LIMIT_SIG_8
OVER_TEMP: R107.2 U41.5(INT) ; port OVER_TEMP
SPI_CLK: U41.1(SCLK) ; port SPI_CLK
SPI_CS0: U37.4(~{G}2A) U37.5(~{G}2B) ; port SPI_CS0
SPI_CS_EXT: U37.15(Y0) ; port SPI_CS_EXT
SPI_MISO: U41.2(DOUT) ; port SPI_MISO
SPI_MOSI: U41.3(DIN) ; port SPI_MOSI
TEMP_SENSOR_~{CS}: U37.13(Y2) U41.4(~{CS})
NetC89_1: C89.1 R84.2 R87.1
NetD22_1: D22.1(LINE) R85.1 U36.2
NetD23_1: D23.1(LINE) R86.1 U36.4
NetD26_1: D26.1(LINE) R88.1 U36.6
NetD27_1: D27.1(LINE) R89.1 U36.8
NetD28_1: D28.1(LINE) R97.1 U39.2
NetD29_1: D29.1(LINE) R98.1 U39.4
NetD30_1: D30.1(LINE) R99.1 U39.6
NetD31_1: D31.1(LINE) R100.1 U39.8

Not connected (* = marked no-connect by the designer): D24 1(LINE)*; D25 1(LINE)*; U35 4(NC1) 5(NC2) 11(NC3) 14(NC4); U37 7(Y7)* 9(Y6)* 10(Y5)* 11(Y4)* 12(Y3)*

### Notes on the sheet
- Title
- Size:
- B
- Number:
- Revision:
- Date:
- Sheet
- of

### Library data of the parts
C87 C88 C90 C92-C94 = CAP-00542: as C65-C73 on sheet SCH8_BBB; Part Number: CAP-00542; Capacitance: 0.1uF; Tolerance: ±10%; Voltage Rating: 16V; Type: X7R
C89 = CAP-00543: CAP, 10000pF, ±10%, 16V, X7R, 0603; Part Number: CAP-00543; Capacitance: 10000pF; Tolerance: ±10%; Voltage Rating: 16V; Type: X7R
D22-D33 = DIO-00057: as D21 on sheet SCH10_BBB_USB; Part Number: DIO-00057; Type: TVS; Cost: 0.38
R84 R87 = RES-00161: RES SMD 60.4 OHM 1% 1/8W 0805; Manufacturer: Rohm Semiconductor; Manufacturer PN: KTR10EZPF60R4; Power Rating: 0.125W; Part Number: RES-00161; Resistance: 60.4; Tolerance: 1%
R85 R86 R88 R89 R97-R100 = RES-00237: RES SMD 470 OHM 1% 1/8W 0805; Manufacturer: Rohm Semiconductor; Manufacturer PN: KTR10EZPF4700; Power Rating: 0.125W; Part Number: RES-00237; Resistance: 470; Tolerance: 1%
R90-R96 R101-R104 R106 R107 = RES-00306: as R53 on sheet SCH8_BBB; Part Number: RES-00306; Resistance: 10k; Tolerance: 1%; Cost: 0.144
R108 R109 = RES-00365: RES SMD 2.2K OHM 1% 1/4W 0603; Manufacturer: Panasonic; Manufacturer PN: ERJ-PA3F2201V; Power Rating: 0.25W; Part Number: RES-00365; Resistance: 2.2k; Tolerance: 1%
U35 = IFACE-00009: Isolated CANbus Transceiver, Single channel, ADM3050E; Manufacturer: Analog Devices; Part Number: IFACE-00009; Manufacturer PN: ADM3050EBRWZ; Cost: 9.62
U36 U39 = IFACE-00012: Opto-Coupler Array, Photo-Transistor Output, TLP291-4; Manufacturer: Toshiba; Part Number: IFACE-00012; Manufacturer PN: TLP291-4
U37 = LOGIC-00035: IC, 3:8 Decoder/Demux, SOIC-16, 2V-6V; Manufacturer: TI; Manufacturer PN: SN74HC138DR; Part Number: LOGIC-00035; Cost: $0.37
U40 = IFACE-00030: IC, Bidirectional I2C Isolator, 2500 Vrms, Low Power, SOIC-8; Manufacturer: TI; Part Number: IFACE-00030; Manufacturer PN: ISO1541DR; Cost: 4.05
U41 = ANLG-00048: IC, 0.5°C Accurate 16-bit Digital SPI Temperature Sensor, SOIC-8, ADT7310; Manufacturer: Analog Devices; Manufacturer PN: ADT7310TRZ; Part Number: ANLG-00048; Cost: 3.93

## Sheet SCH12_AFE.SchDoc: Beaglebone Black - AFE
size B; Organization: CWRUbotix; Address1: 10900 Euclid Avenue; Address2: Cleveland, OH 44106; Address3: USA; Revision: 1.0; SheetNumber: 12; SheetTotal: 13
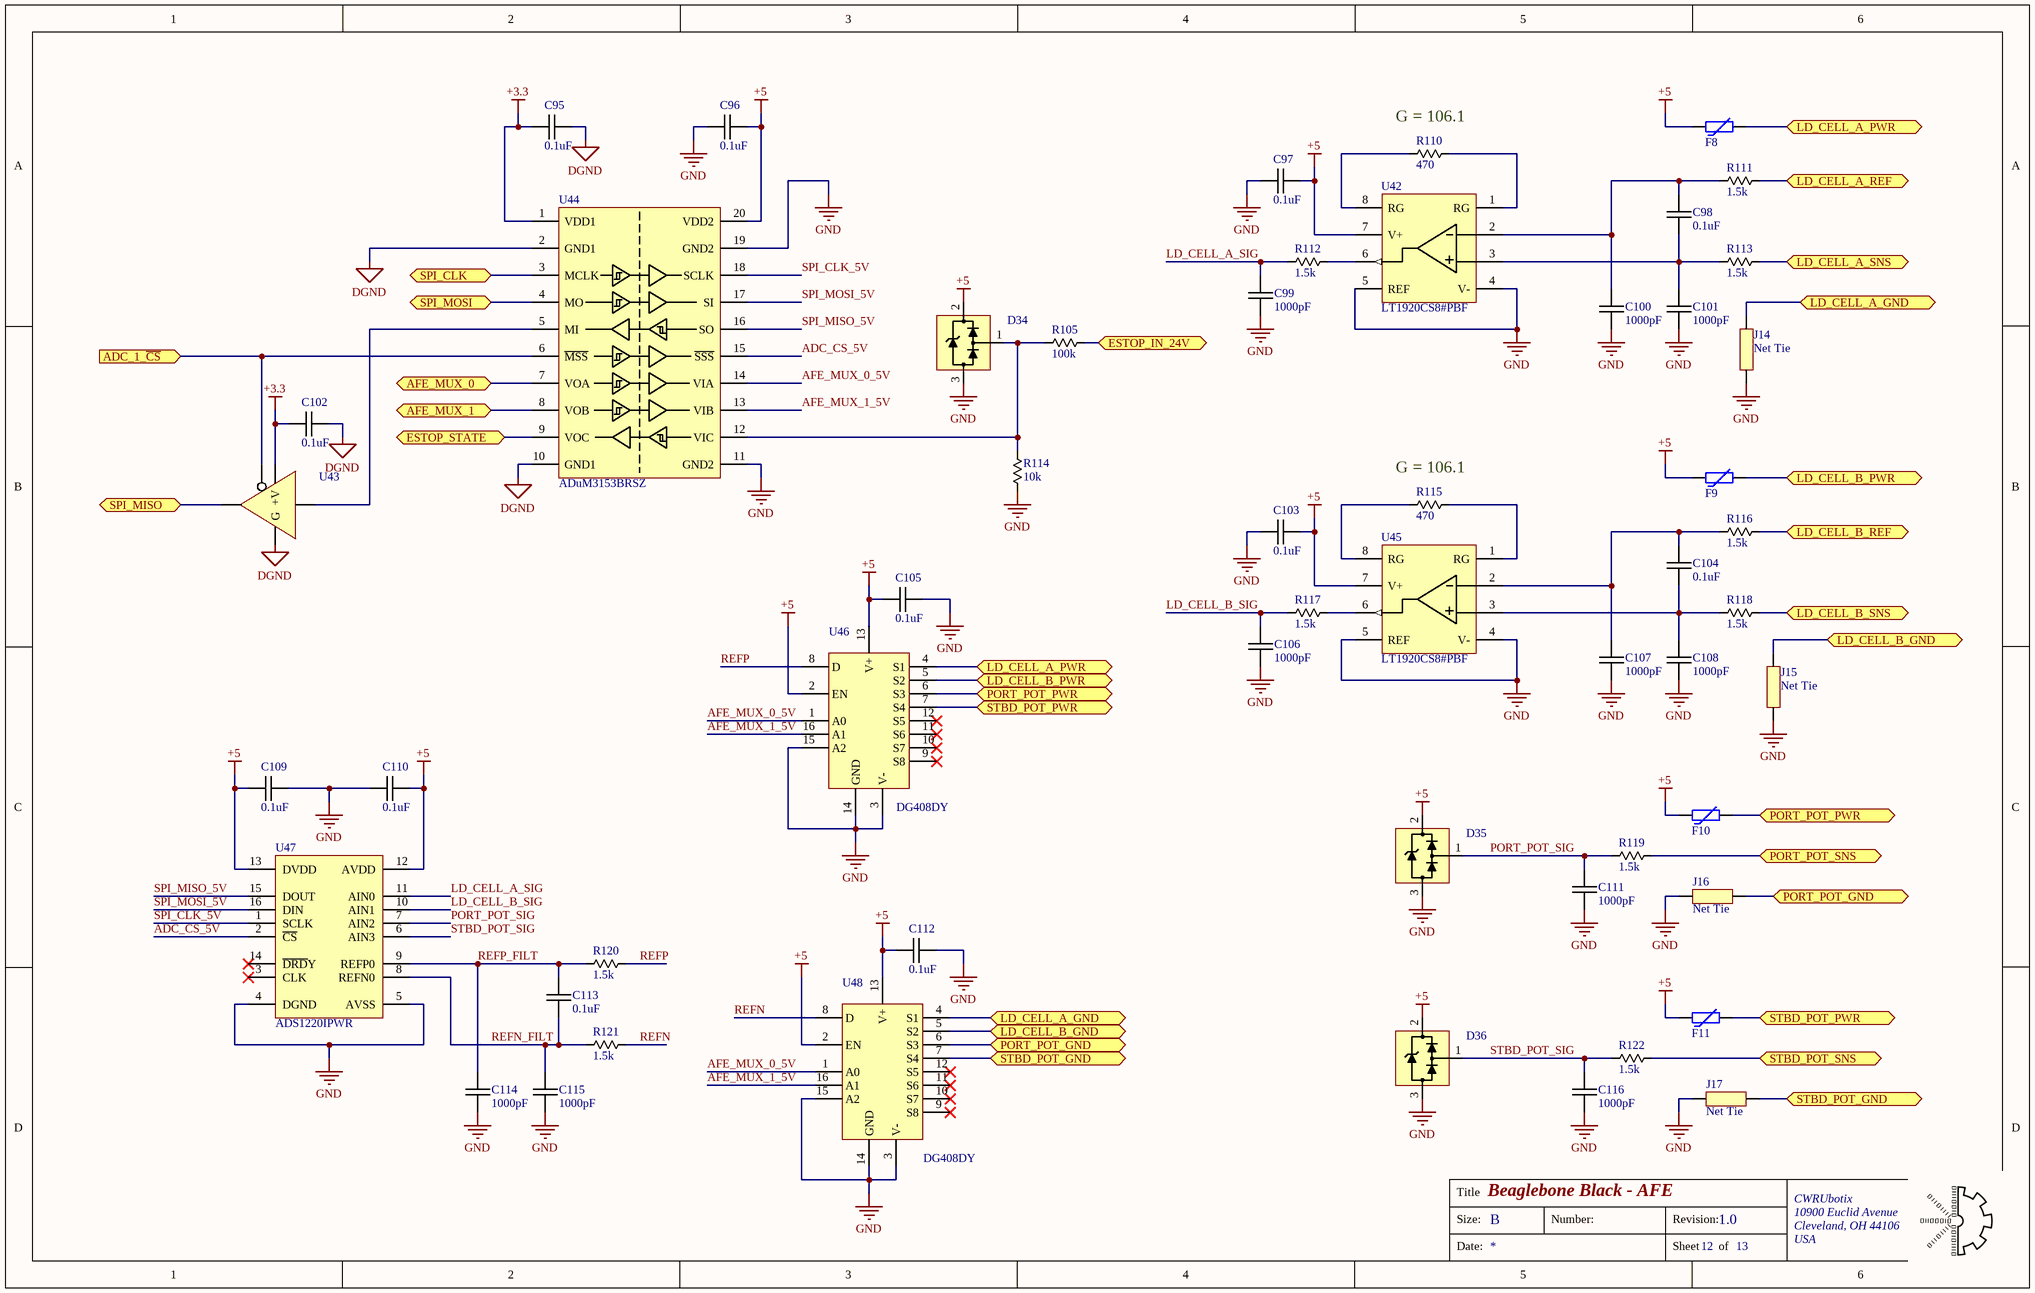
[diagram p11: SCH12_AFE.SchDoc]

### Parts
C95  0.1uF  [chip_0603]
C96  0.1uF  [chip_0603]
C97  0.1uF  [chip_0603]
C98  0.1uF  [chip_0603]
C99  1000pF  [chip_0603]
C100  1000pF  [chip_0603]
C101  1000pF  [chip_0603]
C102  0.1uF  [chip_0603]
C103  0.1uF  [chip_0603]
C104  0.1uF  [chip_0603]
C105  0.1uF  [chip_0603]
C106  1000pF  [chip_0603]
C107  1000pF  [chip_0603]
C108  1000pF  [chip_0603]
C109  0.1uF  [chip_0603]
C110  0.1uF  [chip_0603]
C111  1000pF  [chip_0603]
C112  0.1uF  [chip_0603]
C113  0.1uF  [chip_0603]
C114  1000pF  [chip_0603]
C115  1000pF  [chip_0603]
C116  1000pF  [chip_0603]
D34  DLPT05  [sot-23-3]  (value not drawn)
D35  DLPT05  [sot-23-3]  (value not drawn)
D36  DLPT05  [sot-23-3]  (value not drawn)
F8  PTC_0  [chip_1206]  (value not drawn)
F9  PTC_0  [chip_1206]  (value not drawn)
F10  PTC_0  [chip_1206]  (value not drawn)
F11  PTC_0  [chip_1206]  (value not drawn)
J14  Net Tie  [net_tie_0]
J15  Net Tie  [net_tie_0]
J16  Net Tie  [net_tie_0]
J17  Net Tie  [net_tie_0]
R105  100k  [chip_0603]
R110  470  [chip_0805]
R111  1.5k  [chip_0603]
R112  1.5k  [chip_0603]
R113  1.5k  [chip_0603]
R114  10k  [chip_0603]
R115  470  [chip_0805]
R116  1.5k  [chip_0603]
R117  1.5k  [chip_0603]
R118  1.5k  [chip_0603]
R119  1.5k  [chip_0603]
R120  1.5k  [chip_0603]
R121  1.5k  [chip_0603]
R122  1.5k  [chip_0603]
U42  LT1920CS8#PBF  [SO-8_1]
U43  SN74AHCT1G125  [sot-23-5]  (value not drawn)
U44  ADuM3153BRSZ  [tssop-20_1]
U45  LT1920CS8#PBF  [SO-8_1]
U46  DG408DY  [SO-16_1]
U47  ADS1220IPWR  [TSSOP-16_0_1]
U48  DG408DY  [SO-16_1]

### Ports
ADC_1_~{CS} (in), AFE_MUX_0 (bidir), AFE_MUX_1 (bidir), ESTOP_IN_24V (bidir), ESTOP_STATE (bidir), LD_CELL_A_GND (bidir), LD_CELL_A_PWR (bidir), LD_CELL_A_REF (bidir), LD_CELL_A_SNS (bidir), LD_CELL_B_GND (bidir), LD_CELL_B_PWR (bidir), LD_CELL_B_REF (bidir), LD_CELL_B_SNS (bidir), PORT_POT_GND (bidir), PORT_POT_PWR (bidir), PORT_POT_SNS (bidir), SPI_CLK (bidir), SPI_MISO (bidir), SPI_MOSI (bidir), STBD_POT_GND (bidir), STBD_POT_PWR (bidir), STBD_POT_SNS (bidir)

### Nets
+3.3: C95.2 C102.2 U43.5(+V) U44.1(VDD1)
+5: C96.1 C97.1 C103.1 C105.2 C109.2 C110.1 C112.2 D34.2(VCC) D35.2(VCC) D36.2(VCC) F8.1 F9.1 F10.1 F11.1 U42.7(V+) U44.20(VDD2) U45.7(V+) U46.2(EN) U46.13(V+) U47.12(AVDD) U47.13(DVDD) U48.2(EN) U48.13(V+)
DGND: C95.1 C102.1 U43.3(G) U44.2(GND1) U44.10(GND1)
GND: C96.2 C97.2 C99.2 C100.2 C101.2 C103.2 C105.1 C106.2 C107.2 C108.2 C109.1 C110.2 C111.2 C112.1 C114.2 C115.2 C116.2 D34.3(GND) D35.3(GND) D36.3(GND) J14.1(NET1) J15.1(NET1) J16.1(NET1) J17.1(NET1) R114.2 U42.4(V-) U42.5(REF) U44.11(GND2) U44.19(GND2) U45.4(V-) U45.5(REF) U46.3(V-) U46.14(GND) U46.15(A2) U47.4(DGND) U47.5(AVSS) U48.3(V-) U48.14(GND) U48.15(A2)
ADC_1_~{CS}: U43.1(~{OE}) U44.6(~{MSS}) ; port ADC_1_~{CS}
ADC_CS_5V: U44.15(~{SSS}) U47.2(~{CS})
AFE_MUX_0: U44.7(VOA) ; port AFE_MUX_0
AFE_MUX_0_5V: U44.14(VIA) U46.1(A0) U48.1(A0)
AFE_MUX_1: U44.8(VOB) ; port AFE_MUX_1
AFE_MUX_1_5V: U44.13(VIB) U46.16(A1) U48.16(A1)
ESTOP_IN_24V: R105.2 ; port ESTOP_IN_24V
ESTOP_STATE: U44.9(VOC) ; port ESTOP_STATE
LD_CELL_A_GND: J14.2(NET2) U48.4(S1) ; port LD_CELL_A_GND
LD_CELL_A_PWR: F8.2 U46.4(S1) ; port LD_CELL_A_PWR
LD_CELL_A_REF: R111.2 ; port LD_CELL_A_REF
LD_CELL_A_SIG: C99.1 R112.1 U47.11(AIN0)
LD_CELL_A_SNS: R113.2 ; port LD_CELL_A_SNS
LD_CELL_B_GND: J15.2(NET2) U48.5(S2) ; port LD_CELL_B_GND
LD_CELL_B_PWR: F9.2 U46.5(S2) ; port LD_CELL_B_PWR
LD_CELL_B_REF: R116.2 ; port LD_CELL_B_REF
LD_CELL_B_SIG: C106.1 R117.1 U47.10(AIN1)
LD_CELL_B_SNS: R118.2 ; port LD_CELL_B_SNS
PORT_POT_GND: J16.2(NET2) U48.6(S3) ; port PORT_POT_GND
PORT_POT_PWR: F10.2 U46.6(S3) ; port PORT_POT_PWR
PORT_POT_SIG: C111.1 D35.1(LINE) R119.1 U47.7(AIN2)
PORT_POT_SNS: R119.2 ; port PORT_POT_SNS
REFN: R121.2 U48.8(D)
REFN_FILT: C113.2 C115.1 R121.1 U47.8(REFN0)
REFP: R120.2 U46.8(D)
REFP_FILT: C113.1 C114.1 R120.1 U47.9(REFP0)
SPI_CLK: U44.3(MCLK) ; port SPI_CLK
SPI_CLK_5V: U44.18(SCLK) U47.1(SCLK)
SPI_MISO: U43.4(Y) ; port SPI_MISO
SPI_MISO_5V: U44.16(SO) U47.15(DOUT)
SPI_MOSI: U44.4(MO) ; port SPI_MOSI
SPI_MOSI_5V: U44.17(SI) U47.16(DIN)
STBD_POT_GND: J17.2(NET2) U48.7(S4) ; port STBD_POT_GND
STBD_POT_PWR: F11.2 U46.7(S4) ; port STBD_POT_PWR
STBD_POT_SIG: C116.1 D36.1(LINE) R122.1 U47.6(AIN3)
STBD_POT_SNS: R122.2 ; port STBD_POT_SNS
NetC98_1: C98.1 C100.1 R111.1 U42.2(-IN)
NetC98_2: C98.2 C101.1 R113.1 U42.3(+IN)
NetC104_1: C104.1 C107.1 R116.1 U45.2(-IN)
NetC104_2: C104.2 C108.1 R118.1 U45.3(+IN)
NetD34_1: D34.1(LINE) R105.1 R114.1 U44.12(VIC)
NetR110_1: R110.1 U42.8(RG)
NetR110_2: R110.2 U42.1(RG)
NetR112_2: R112.2 U42.6(OUT)
NetR115_1: R115.1 U45.8(RG)
NetR115_2: R115.2 U45.1(RG)
NetR117_2: R117.2 U45.6(OUT)
NetU43_2: U43.2(A) U44.5(MI)

Not connected (* = marked no-connect by the designer): U46 9(S8)* 10(S7)* 11(S6)* 12(S5)*; U47 3(CLK)* 14(~{DRD}Y)*; U48 9(S8)* 10(S7)* 11(S6)* 12(S5)*

### Notes on the sheet
- (near R110) G = 106.1
- (near R115) G = 106.1
- Title
- Size:
- B
- Number:
- Revision:
- Date:
- Sheet
- of

### Library data of the parts
C95-C98 C102-C105 C109 C110 C112 C113 = CAP-00542: as C65-C73 on sheet SCH8_BBB; Part Number: CAP-00542; Capacitance: 0.1uF; Tolerance: ±10%; Voltage Rating: 16V; Type: X7R
C99-C101 C106-C108 C111 C114-C116 = CAP-00457: CAP, 1000pF, ±1%, 50V, C0G, 0603; Manufacturer: Murata; Manufacturer PN: GRM1885C1H102FA01D; Part Number: CAP-00457; Capacitance: 1000pF; Tolerance: ±1%; Voltage Rating: 50V; Type: C0G
D34-D36 = DIO-00057: as D21 on sheet SCH10_BBB_USB; Part Number: DIO-00057; Type: TVS; Cost: 0.38
F8-F11 = MISC-00008: PTC Resettable fuse, 6V, 500mA, 1206; Manufacturer: Eaton; Manufacturer PN: PTS12066V050; Part Number: MISC-00008; Cost: 0.3
J14-J17 = MISC-00039: Part Number: MISC-00039
R105 = RES-00301: as R55 on sheet SCH8_BBB; Part Number: RES-00301; Resistance: 100k; Tolerance: 1%
R110 R115 = RES-00237: as R85 on sheet SCH11_Digital_IO; Part Number: RES-00237; Resistance: 470; Tolerance: 1%
R111-R113 R116-R122 = RES-00284: as R73 on sheet SCH9_BBB_Eth; Part Number: RES-00284; Resistance: 1.5k; Tolerance: 1%
R114 = RES-00306: as R53 on sheet SCH8_BBB; Part Number: RES-00306; Resistance: 10k; Tolerance: 1%; Cost: 0.144
U42 U45 = ANLG-00071: IC, Instrumentation Amp, Single, 4.6 ~ 36V supply, SOIC-8; Manufacturer: Linear Technology; Part Number: ANLG-00071; Manufacturer PN: LT1920CS8#PBF; Cost: 7.61
U43 = LOGIC-00027: Tri-State Buffer, Single, 2-5.5V, SOT-23-5, SN74AHC1G125; Manufacturer: TI; Manufacturer PN: SN74AHC1G125DBVR; Part Number: LOGIC-00027; Cost: $0.33
U44 = IFACE-00029: Digital Isolator, SPI-bus optomized, ADuM3151; Manufacturer: Analog Devices; Part Number: IFACE-00029; Manufacturer PN: ADuM3153BRSZ; Cost: 6.69
U46 U48 = ANLG-00072: Analog Mux, 8:1, 5 ~ 36V, SOIC-16; Manufacturer: Vishay; Part Number: ANLG-00072; Manufacturer PN: DG408DY; Cost: 1.77
U47 = ANLG-00073: IC, ADC 24-bit 4-Channel MUX-PGA, Sigma-Delta, 2k SPS, 16-TSSOP; Manufacturer: TI; Part Number: ANLG-00073; Manufacturer PN: ADS1220IPWR; Cost: 8.27

## Sheet SCH13_RS232.SchDoc: Beaglebone Black - RS232
size B; Organization: CWRUbotix; Address1: 10900 Euclid Avenue; Address2: Cleveland, OH 44106; Address3: USA; Revision: 1.0; SheetNumber: 13; SheetTotal: 13
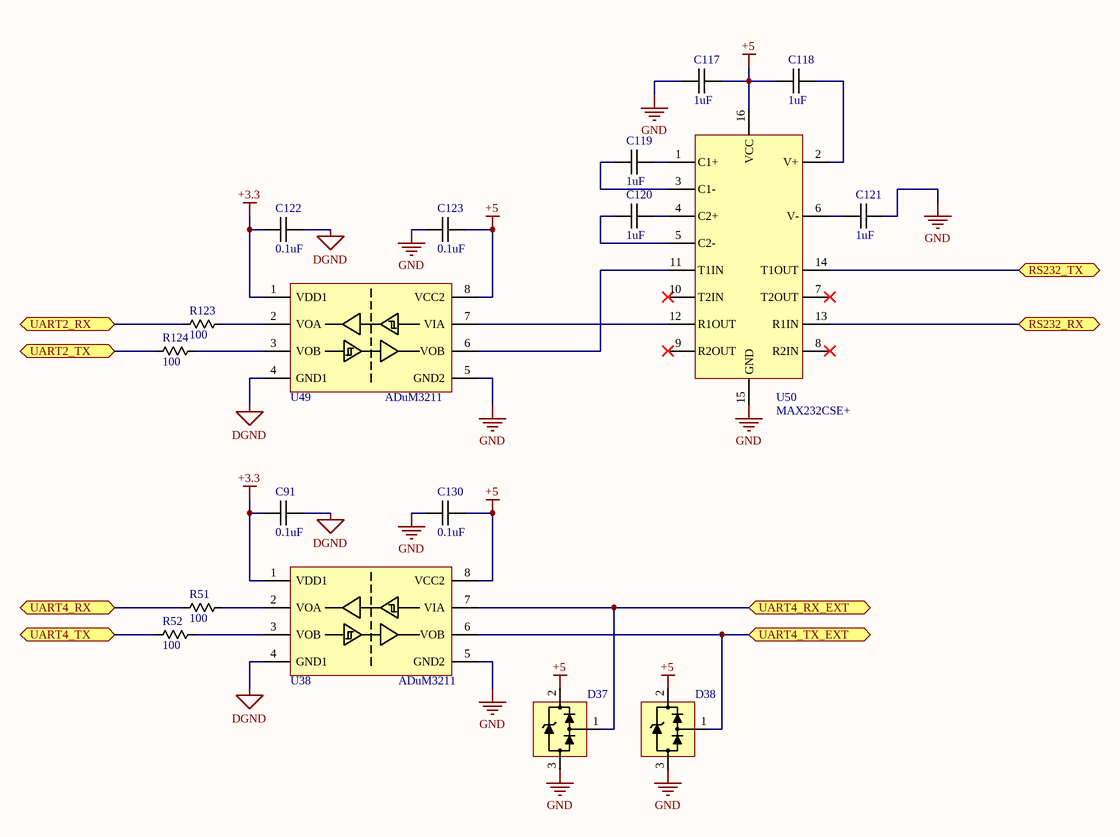
[diagram p12: SCH13_RS232.SchDoc]

### Parts
C91  0.1uF  [chip_0603]
C117  1uF  [chip_0805]
C118  1uF  [chip_0805]
C119  1uF  [chip_0805]
C120  1uF  [chip_0805]
C121  1uF  [chip_0805]
C122  0.1uF  [chip_0603]
C123  0.1uF  [chip_0603]
C130  0.1uF  [chip_0603]
D37  DLPT05  [sot-23-3]  (value not drawn)
D38  DLPT05  [sot-23-3]  (value not drawn)
R51  100  [chip_0603]
R52  100  [chip_0603]
R123  100  [chip_0603]
R124  100  [chip_0603]
U38  ADuM3211  [SO-8]
U49  ADuM3211  [SO-8]
U50  MAX232CSE+  [SO-16]

### Ports
RS232_RX (bidir), RS232_TX (bidir), UART2_RX (bidir), UART2_TX (bidir), UART4_RX (bidir), UART4_RX_EXT (bidir), UART4_TX (bidir), UART4_TX_EXT (bidir)

### Nets
+3.3: C91.2 C122.2 U38.1(VDD1) U49.1(VDD1)
+5: C117.2 C118.1 C123.1 C130.1 D37.2(VCC) D38.2(VCC) U38.8(VCC2) U49.8(VCC2) U50.16(VCC)
DGND: C91.1 C122.1 U38.4(GND1) U49.4(GND1)
GND: C117.1 C121.2 C123.2 C130.2 D37.3(GND) D38.3(GND) U38.5(GND2) U49.5(GND2) U50.15(GND)
RS232_RX: U50.13(R1IN) ; port RS232_RX
RS232_TX: U50.14(T1OUT) ; port RS232_TX
UART2_RX: R123.1 ; port UART2_RX
UART2_TX: R124.1 ; port UART2_TX
UART4_RX: R51.1 ; port UART4_RX
UART4_RX_EXT: D37.1(LINE) U38.7(VIA) ; port UART4_RX_EXT
UART4_TX: R52.1 ; port UART4_TX
UART4_TX_EXT: D38.1(LINE) U38.6(VOB) ; port UART4_TX_EXT
NetC118_2: C118.2 U50.2(V+)
NetC119_1: C119.1 U50.3(C1-)
NetC119_2: C119.2 U50.1(C1+)
NetC120_1: C120.1 U50.5(C2-)
NetC120_2: C120.2 U50.4(C2+)
NetC121_1: C121.1 U50.6(V-)
NetR51_2: R51.2 U38.2(VOA)
NetR52_2: R52.2 U38.3(VOB)
NetR123_2: R123.2 U49.2(VOA)
NetR124_2: R124.2 U49.3(VOB)
NetU49_6: U49.6(VOB) U50.11(T1IN)
NetU49_7: U49.7(VIA) U50.12(R1OUT)

Not connected (* = marked no-connect by the designer): U50 7(T2OUT)* 8(R2IN)* 9(R2OUT)* 10(T2IN)*

### Notes on the sheet
- Title
- Size:
- B
- Number:
- Revision:
- Date:
- Sheet
- of

### Library data of the parts
C91 C122 C123 C130 = CAP-00542: as C65-C73 on sheet SCH8_BBB; Part Number: CAP-00542; Capacitance: 0.1uF; Tolerance: ±10%; Voltage Rating: 16V; Type: X7R
C117-C121 = CAP-00110: as C80 on sheet SCH9_BBB_Eth; Part Number: CAP-00110; Capacitance: 1uF; Tolerance: 10%; Voltage Rating: 16V; Type: X7R
D37 D38 = DIO-00057: as D21 on sheet SCH10_BBB_USB; Part Number: DIO-00057; Type: TVS; Cost: 0.38
R51 R52 R123 R124 = RES-00178: as R65 on sheet SCH8_BBB; Part Number: RES-00178; Resistance: 100; Tolerance: 1%
U38 U49 = IFACE-00015: Digital Isolator, Dual-Channel, ADuM3211; Manufacturer: Analog Devices; Manufacturer PN: ADuM3211ARZ; Part Number: IFACE-00015; Cost: 2.87
U50 = IFACE-00031: IC, RS-232 Transceiver, Dual Channel, SOIC-16; Manufacturer: Maxim Integrated; Part Number: IFACE-00031; Manufacturer PN: MAX232CSE+; Cost: 2.92